# EAGLE schematic module_decoding_b (EAGLE 6.5.0)

## Sheet 1 of 11
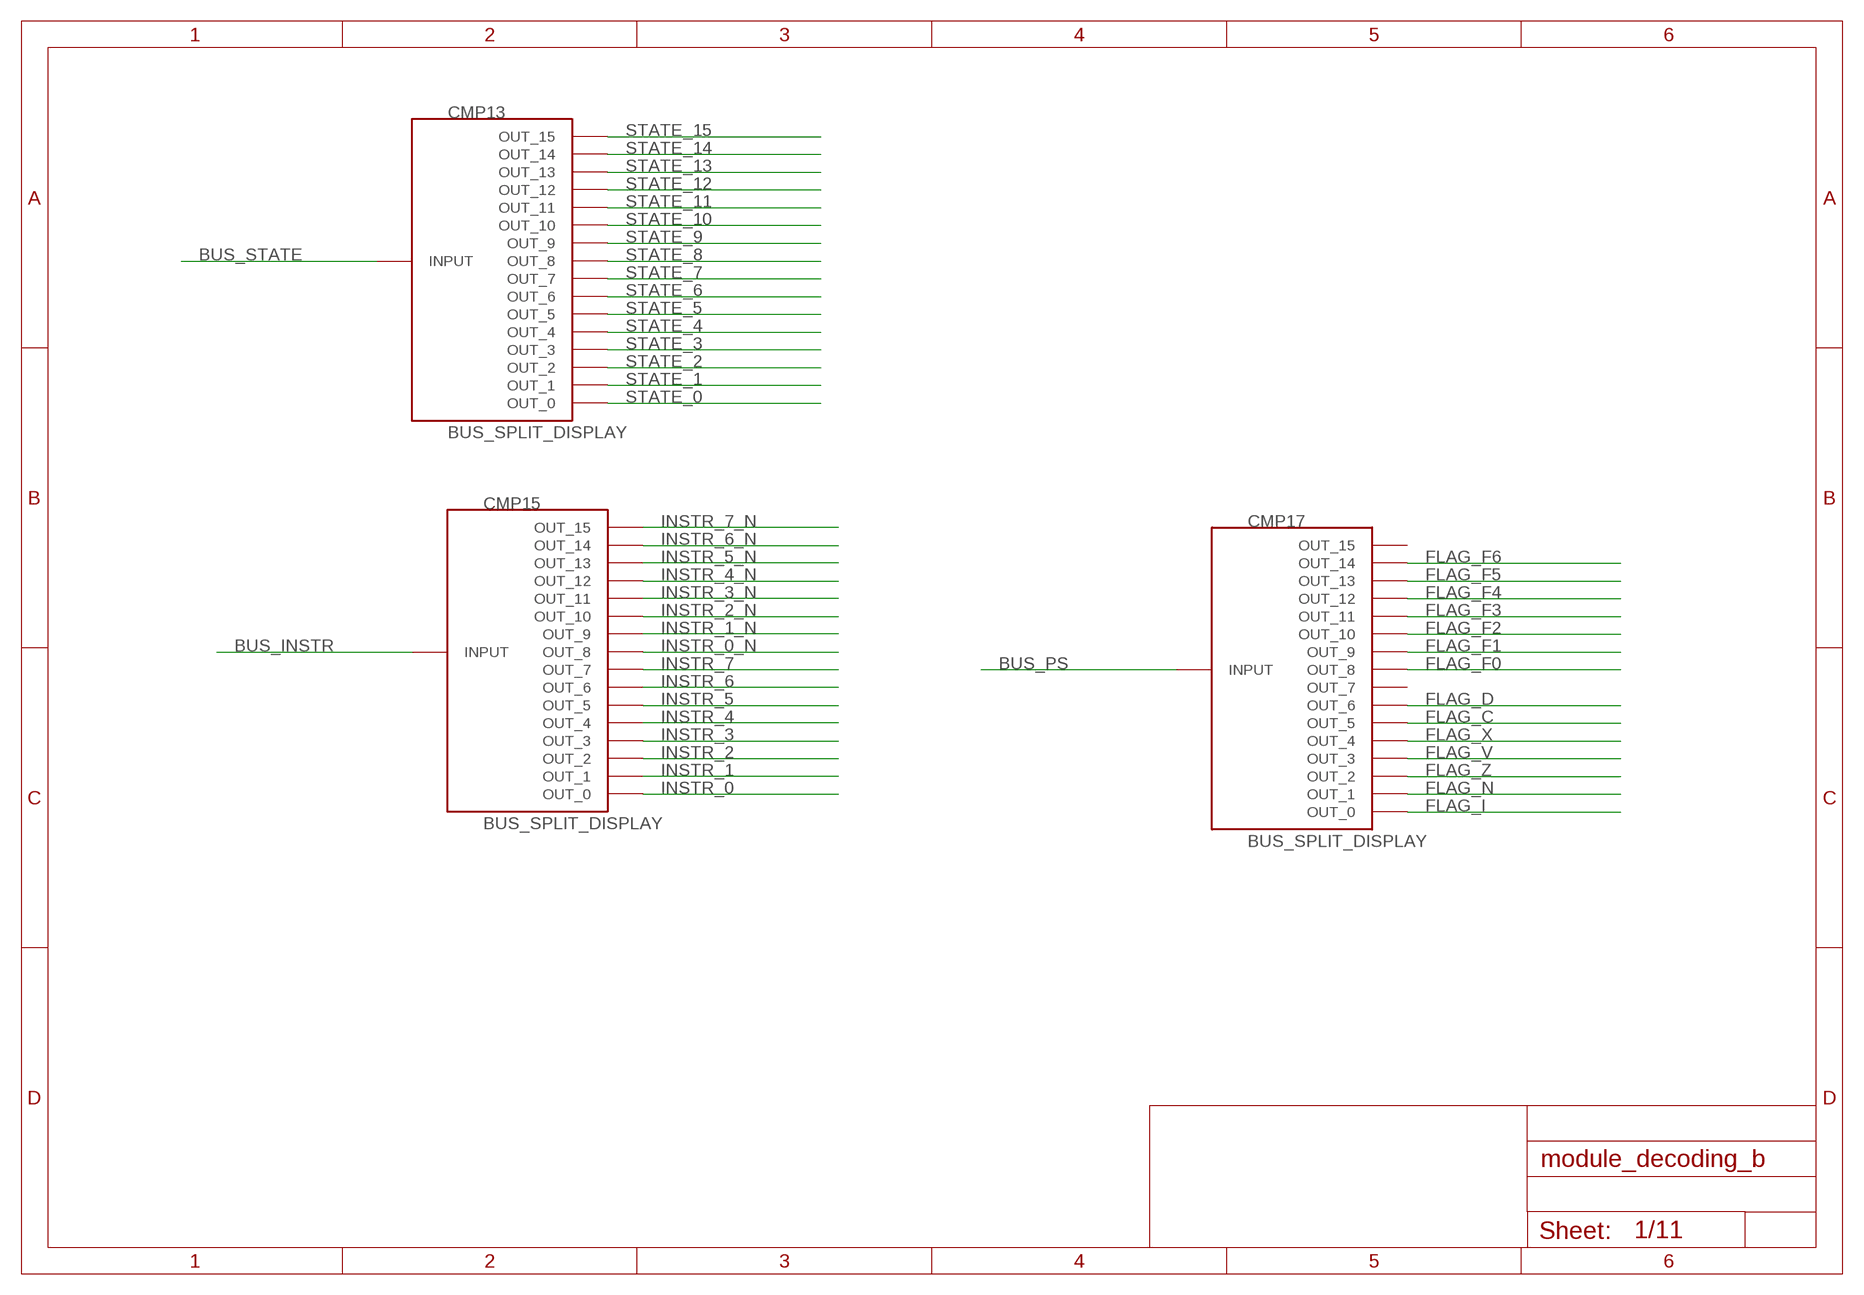
[diagram p0: schematic, sheet 1]

### Parts
CMP13  BUS_SPLIT_DISPLAY  [BUS_SPLIT_DISPLAY]
CMP15  BUS_SPLIT_DISPLAY  [BUS_SPLIT_DISPLAY]
CMP17  BUS_SPLIT_DISPLAY  [BUS_SPLIT_DISPLAY]

### Nets
BUS_INSTR: CMP15.INPUT
BUS_PS: CMP17.INPUT
BUS_STATE: CMP13.INPUT
FLAG_C: CMP17.P$6(OUT_5)
FLAG_D: CMP17.P$7(OUT_6)
FLAG_F0: CMP17.P$9(OUT_8) ; also sheet 6
FLAG_F1: CMP17.P$10(OUT_9) ; also sheet 6
FLAG_F2: CMP17.P$11(OUT_10)
FLAG_F3: CMP17.P$12(OUT_11) ; also sheet 8
FLAG_F4: CMP17.P$13(OUT_12)
FLAG_F5: CMP17.P$14(OUT_13)
FLAG_F6: CMP17.P$15(OUT_14)
FLAG_I: CMP17.P$1(OUT_0)
FLAG_N: CMP17.P$2(OUT_1)
FLAG_V: CMP17.P$4(OUT_3)
FLAG_X: CMP17.P$5(OUT_4) ; also sheet 8
FLAG_Z: CMP17.P$3(OUT_2)
INSTR_0: CMP15.P$1(OUT_0)
INSTR_0_N: CMP15.P$9(OUT_8)
INSTR_1: CMP15.P$2(OUT_1)
INSTR_1_N: CMP15.P$10(OUT_9)
INSTR_2: CMP15.P$3(OUT_2)
INSTR_2_N: CMP15.P$11(OUT_10) ; also sheet 8
INSTR_3: CMP15.P$4(OUT_3) ; also sheet 8
INSTR_3_N: CMP15.P$12(OUT_11)
INSTR_4: CMP15.P$5(OUT_4)
INSTR_4_N: CMP15.P$13(OUT_12)
INSTR_5: CMP15.P$6(OUT_5)
INSTR_5_N: CMP15.P$14(OUT_13)
INSTR_6: CMP15.P$7(OUT_6)
INSTR_6_N: CMP15.P$15(OUT_14)
INSTR_7: CMP15.P$8(OUT_7)
INSTR_7_N: CMP15.P$16(OUT_15)
STATE_0: CMP13.P$1(OUT_0) ; also sheet 5,7
STATE_1: CMP13.P$2(OUT_1)
STATE_2: CMP13.P$3(OUT_2) ; also sheet 5
STATE_3: CMP13.P$4(OUT_3) ; also sheet 6
STATE_4: CMP13.P$5(OUT_4)
STATE_5: CMP13.P$6(OUT_5) ; also sheet 7
STATE_6: CMP13.P$7(OUT_6)
STATE_7: CMP13.P$8(OUT_7) ; also sheet 5
STATE_8: CMP13.P$9(OUT_8)
STATE_9: CMP13.P$10(OUT_9)
STATE_10: CMP13.P$11(OUT_10)
STATE_11: CMP13.P$12(OUT_11)
STATE_12: CMP13.P$13(OUT_12)
STATE_13: CMP13.P$14(OUT_13) ; also sheet 8
STATE_14: CMP13.P$15(OUT_14)
STATE_15: CMP13.P$16(OUT_15)
Unconnected: CMP17.P$8(OUT_7) CMP17.P$16(OUT_15)

## Sheet 2 of 11
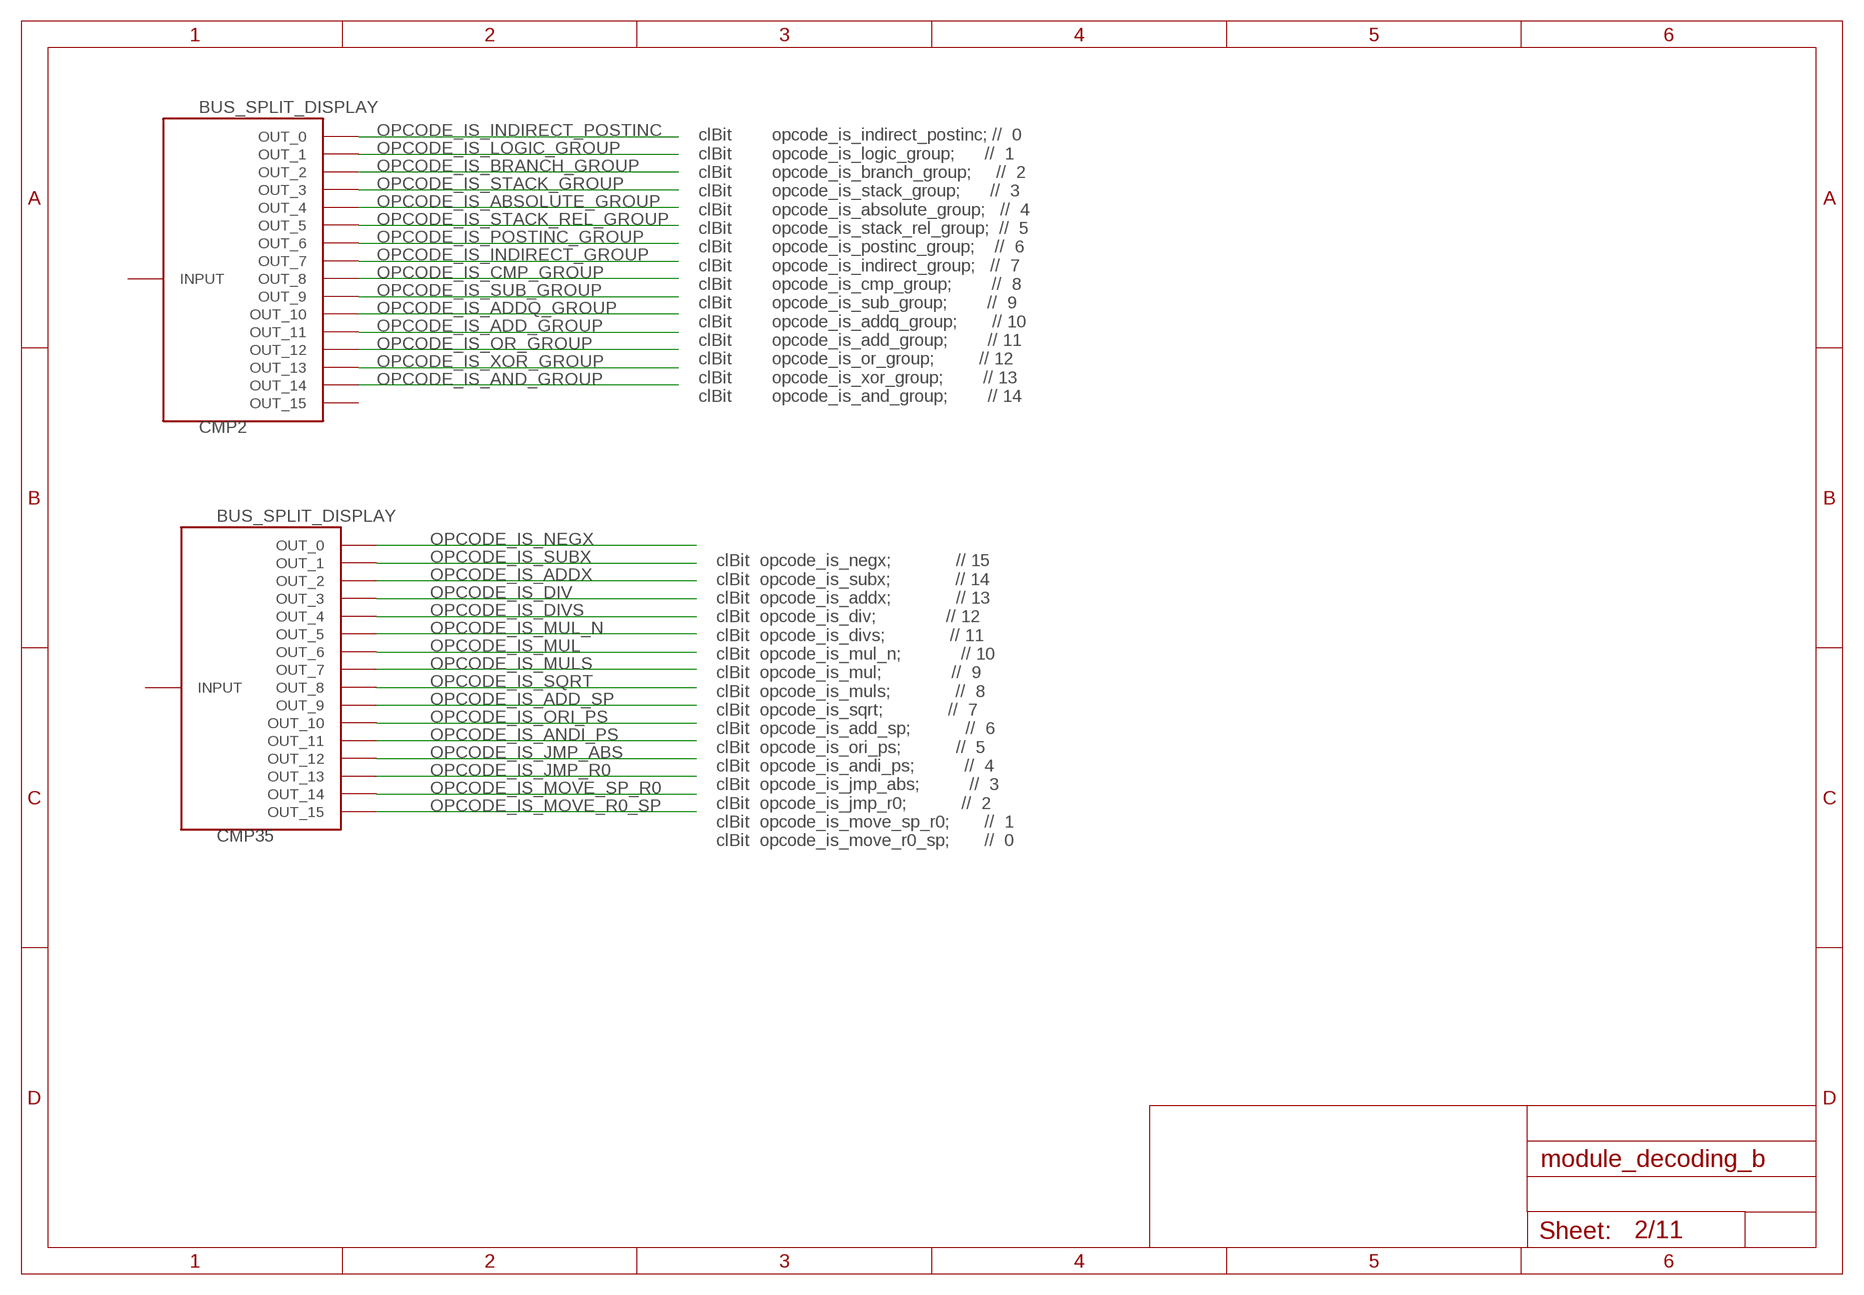
[diagram p1: schematic, sheet 2]

### Parts
CMP2  BUS_SPLIT_DISPLAY  [BUS_SPLIT_DISPLAY]
CMP35  BUS_SPLIT_DISPLAY  [BUS_SPLIT_DISPLAY]

### Nets
OPCODE_IS_ABSOLUTE_GROUP: CMP2.P$5(OUT_4)
OPCODE_IS_ADD_GROUP: CMP2.P$12(OUT_11) ; also sheet 7,10
OPCODE_IS_ADD_SP: CMP35.P$10(OUT_9) ; also sheet 5
OPCODE_IS_ADDQ_GROUP: CMP2.P$11(OUT_10) ; also sheet 7,8,10
OPCODE_IS_ADDX: CMP35.P$3(OUT_2) ; also sheet 10,11
OPCODE_IS_AND_GROUP: CMP2.P$15(OUT_14) ; also sheet 10
OPCODE_IS_ANDI_PS: CMP35.P$12(OUT_11) ; also sheet 9
OPCODE_IS_BRANCH_GROUP: CMP2.P$3(OUT_2) ; also sheet 5,9
OPCODE_IS_CMP_GROUP: CMP2.P$9(OUT_8) ; also sheet 10
OPCODE_IS_DIV: CMP35.P$4(OUT_3) ; also sheet 5,10,11
OPCODE_IS_DIVS: CMP35.P$5(OUT_4) ; also sheet 5,6
OPCODE_IS_INDIRECT_GROUP: CMP2.P$8(OUT_7)
OPCODE_IS_INDIRECT_POSTINC: CMP2.P$1(OUT_0) ; also sheet 10,11
OPCODE_IS_JMP_ABS: CMP35.P$13(OUT_12)
OPCODE_IS_JMP_R0: CMP35.P$14(OUT_13) ; also sheet 10
OPCODE_IS_LOGIC_GROUP: CMP2.P$2(OUT_1) ; also sheet 10
OPCODE_IS_MOVE_R0_SP: CMP35.P$16(OUT_15) ; also sheet 5
OPCODE_IS_MOVE_SP_R0: CMP35.P$15(OUT_14) ; also sheet 10
OPCODE_IS_MUL: CMP35.P$7(OUT_6) ; also sheet 11
OPCODE_IS_MUL_N: CMP35.P$6(OUT_5) ; also sheet 8,10
OPCODE_IS_MULS: CMP35.P$8(OUT_7) ; also sheet 10,11
OPCODE_IS_NEGX: CMP35.P$1(OUT_0) ; also sheet 10,11
OPCODE_IS_OR_GROUP: CMP2.P$13(OUT_12) ; also sheet 10
OPCODE_IS_ORI_PS: CMP35.P$11(OUT_10) ; also sheet 9
OPCODE_IS_POSTINC_GROUP: CMP2.P$7(OUT_6) ; also sheet 11
OPCODE_IS_SQRT: CMP35.P$9(OUT_8) ; also sheet 10,11
OPCODE_IS_STACK_GROUP: CMP2.P$4(OUT_3) ; also sheet 10,11
OPCODE_IS_STACK_REL_GROUP: CMP2.P$6(OUT_5) ; also sheet 5
OPCODE_IS_SUB_GROUP: CMP2.P$10(OUT_9) ; also sheet 9,10
OPCODE_IS_SUBX: CMP35.P$2(OUT_1) ; also sheet 10,11
OPCODE_IS_XOR_GROUP: CMP2.P$14(OUT_13) ; also sheet 10
Unconnected: CMP2.INPUT CMP2.P$16(OUT_15) CMP35.INPUT

### Notes on the sheet
- clBit        opcode_is_indirect_postinc; //  0
      clBit        opcode_is_logic_group;      //  1
      clBit        opcode_is_branch_group;     //  2
      clBit        opcode_is_stack_group;      //  3
      clBit        opcode_is_absolute_group;   //  4
      clBit        opcode_is_stack_rel_group;  //  5
      clBit        opcode_is_postinc_group;    //  6
      clBit        opcode_is_indirect_group;   //  7
      clBit        opcode_is_cmp_group;        //  8
      clBit        opcode_is_sub_group;        //  9
      clBit        opcode_is_addq_group;       // 10
      clBit        opcode_is_add_group;        // 11
      clBit        opcode_is_or_group;         // 12
      clBit        opcode_is_xor_group;        // 13
      clBit        opcode_is_and_group;        // 14
- clBit  opcode_is_negx;             // 15
      clBit  opcode_is_subx;             // 14
      clBit  opcode_is_addx;             // 13
      clBit  opcode_is_div;              // 12
      clBit  opcode_is_divs;             // 11
      clBit  opcode_is_mul_n;            // 10
      clBit  opcode_is_mul;              //  9
      clBit  opcode_is_muls;             //  8
      clBit  opcode_is_sqrt;             //  7
      clBit  opcode_is_add_sp;           //  6
      clBit  opcode_is_ori_ps;           //  5
      clBit  opcode_is_andi_ps;          //  4
      clBit  opcode_is_jmp_abs;          //  3
      clBit  opcode_is_jmp_r0;           //  2
      clBit  opcode_is_move_sp_r0;       //  1
      clBit  opcode_is_move_r0_sp;       //  0

## Sheet 3 of 11
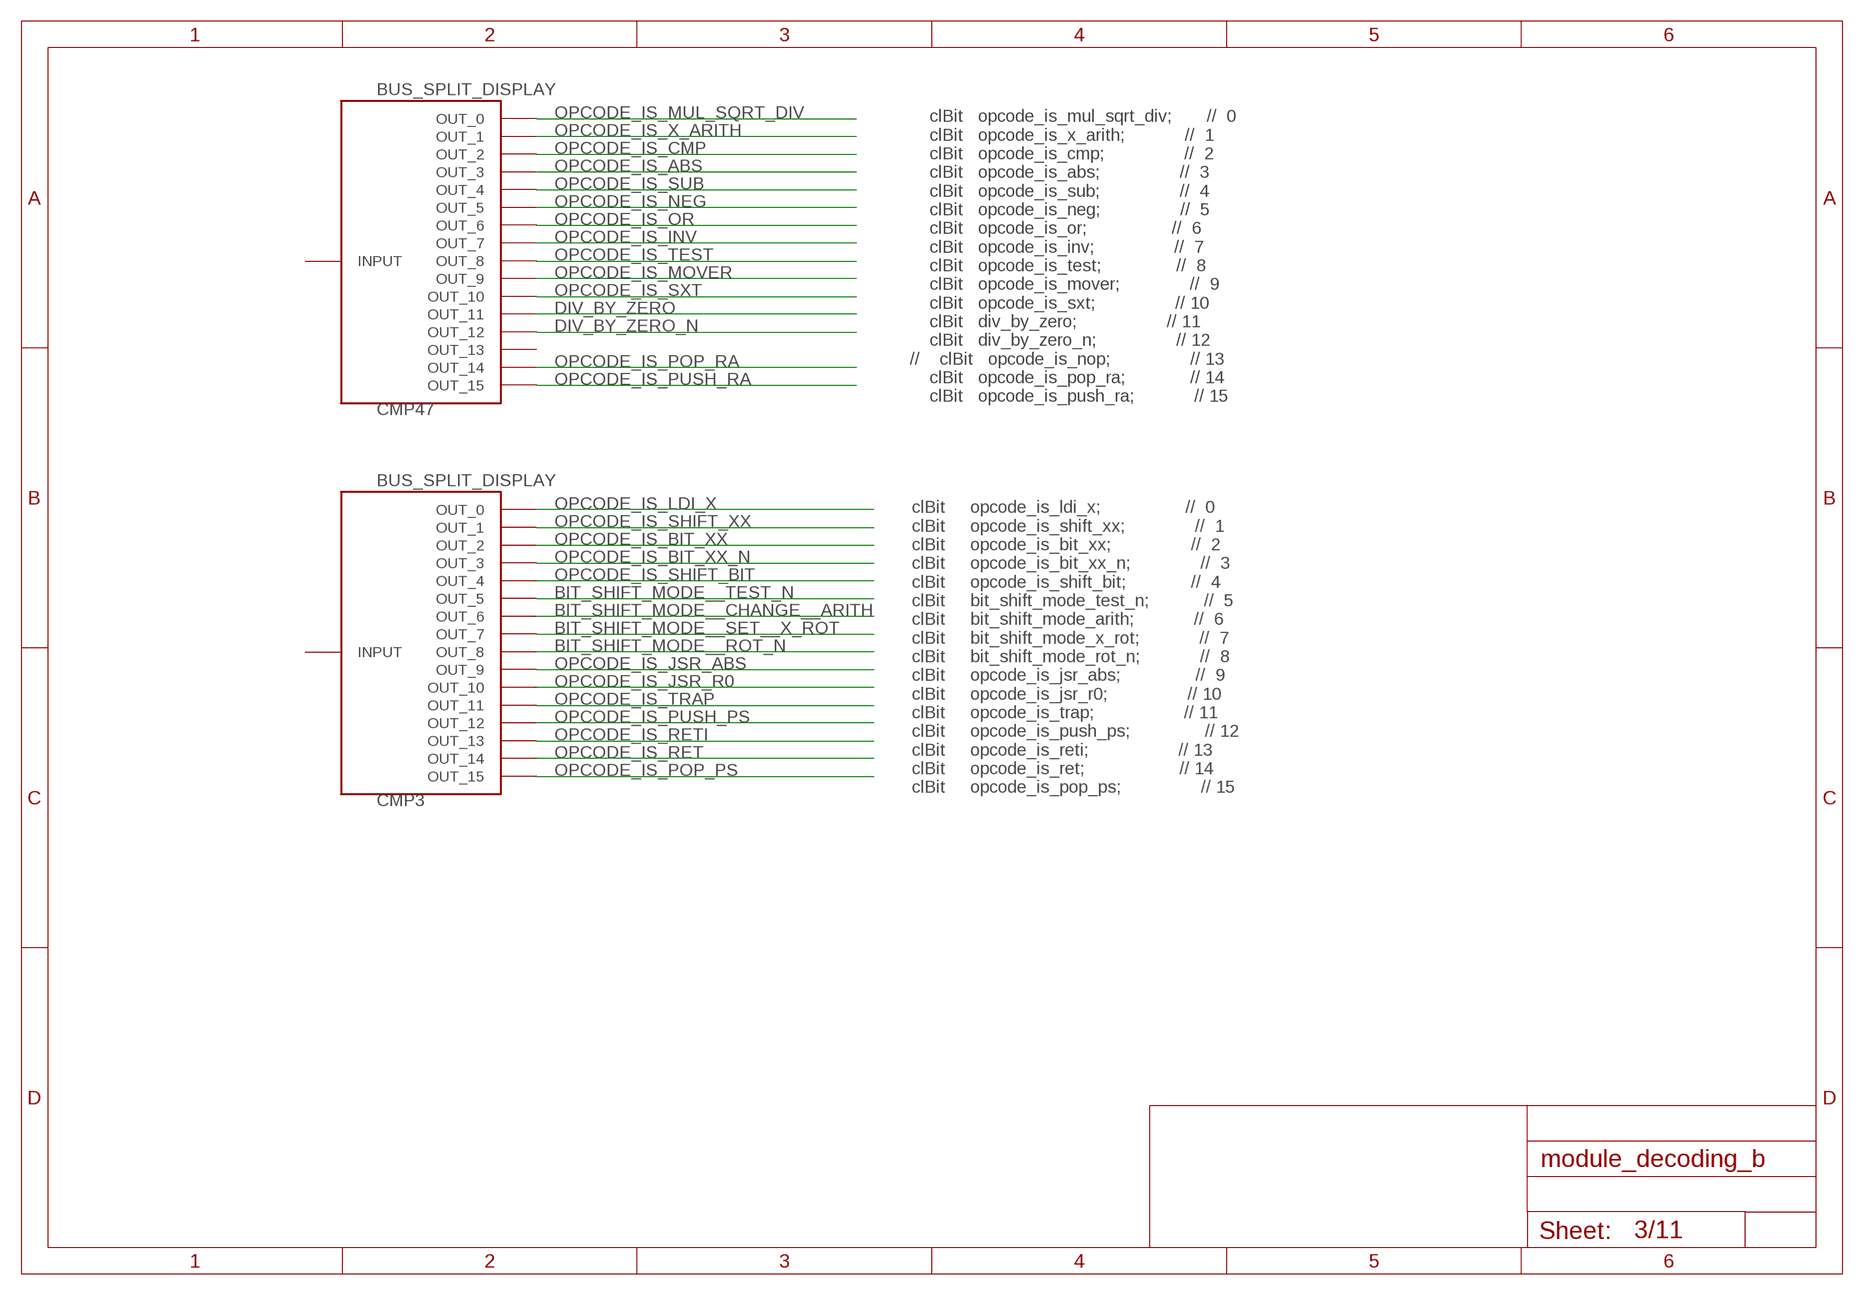
[diagram p2: schematic, sheet 3]

### Parts
CMP3  BUS_SPLIT_DISPLAY  [BUS_SPLIT_DISPLAY]
CMP47  BUS_SPLIT_DISPLAY  [BUS_SPLIT_DISPLAY]

### Nets
BIT_SHIFT_MODE__CHANGE__ARITH: CMP3.P$7(OUT_6) ; also sheet 9
BIT_SHIFT_MODE__ROT_N: CMP3.P$9(OUT_8) ; also sheet 7
BIT_SHIFT_MODE__SET__X_ROT: CMP3.P$8(OUT_7) ; also sheet 9
BIT_SHIFT_MODE__TEST_N: CMP3.P$6(OUT_5) ; also sheet 6
DIV_BY_ZERO: CMP47.P$12(OUT_11) ; also sheet 9
DIV_BY_ZERO_N: CMP47.P$13(OUT_12) ; also sheet 11
OPCODE_IS_ABS: CMP47.P$4(OUT_3) ; also sheet 9,10
OPCODE_IS_BIT_XX: CMP3.P$3(OUT_2) ; also sheet 6,9,10
OPCODE_IS_BIT_XX_N: CMP3.P$4(OUT_3) ; also sheet 10
OPCODE_IS_CMP: CMP47.P$3(OUT_2) ; also sheet 6,9,10
OPCODE_IS_INV: CMP47.P$8(OUT_7) ; also sheet 10
OPCODE_IS_JSR_ABS: CMP3.P$10(OUT_9) ; also sheet 10,11
OPCODE_IS_JSR_R0: CMP3.P$11(OUT_10) ; also sheet 10,11
OPCODE_IS_LDI_X: CMP3.P$1(OUT_0) ; also sheet 7,11
OPCODE_IS_MOVER: CMP47.P$10(OUT_9) ; also sheet 10
OPCODE_IS_MUL_SQRT_DIV: CMP47.P$1(OUT_0) ; also sheet 7,9
OPCODE_IS_NEG: CMP47.P$6(OUT_5) ; also sheet 9,10
OPCODE_IS_OR: CMP47.P$7(OUT_6) ; also sheet 10
OPCODE_IS_POP_PS: CMP3.P$16(OUT_15) ; also sheet 6,9,11
OPCODE_IS_POP_RA: CMP47.P$15(OUT_14) ; also sheet 6,7
OPCODE_IS_PUSH_PS: CMP3.P$13(OUT_12) ; also sheet 10
OPCODE_IS_PUSH_RA: CMP47.P$16(OUT_15) ; also sheet 7,10
OPCODE_IS_RET: CMP3.P$15(OUT_14) ; also sheet 6
OPCODE_IS_RETI: CMP3.P$14(OUT_13) ; also sheet 6
OPCODE_IS_SHIFT_BIT: CMP3.P$5(OUT_4) ; also sheet 11
OPCODE_IS_SHIFT_XX: CMP3.P$2(OUT_1) ; also sheet 7,9,10
OPCODE_IS_SUB: CMP47.P$5(OUT_4) ; also sheet 9,10
OPCODE_IS_SXT: CMP47.P$11(OUT_10) ; also sheet 7,11
OPCODE_IS_TEST: CMP47.P$9(OUT_8) ; also sheet 6
OPCODE_IS_TRAP: CMP3.P$12(OUT_11) ; also sheet 9,10,11
OPCODE_IS_X_ARITH: CMP47.P$2(OUT_1) ; also sheet 9,11
Unconnected: CMP3.INPUT CMP47.INPUT CMP47.P$14(OUT_13)

### Notes on the sheet
- clBit   opcode_is_mul_sqrt_div;       //  0
      clBit   opcode_is_x_arith;            //  1
      clBit   opcode_is_cmp;                //  2
      clBit   opcode_is_abs;                //  3
      clBit   opcode_is_sub;                //  4
      clBit   opcode_is_neg;                //  5
      clBit   opcode_is_or;                 //  6
      clBit   opcode_is_inv;                //  7
      clBit   opcode_is_test;               //  8
      clBit   opcode_is_mover;              //  9
      clBit   opcode_is_sxt;                // 10
      clBit   div_by_zero;                  // 11
      clBit   div_by_zero_n;                // 12
  //    clBit   opcode_is_nop;                // 13
      clBit   opcode_is_pop_ra;             // 14
      clBit   opcode_is_push_ra;            // 15
- clBit     opcode_is_ldi_x;                 //  0
      clBit     opcode_is_shift_xx;              //  1
      clBit     opcode_is_bit_xx;                //  2
      clBit     opcode_is_bit_xx_n;              //  3
      clBit     opcode_is_shift_bit;             //  4
      clBit     bit_shift_mode_test_n;           //  5
      clBit     bit_shift_mode_arith;            //  6
      clBit     bit_shift_mode_x_rot;            //  7
      clBit     bit_shift_mode_rot_n;            //  8
      clBit     opcode_is_jsr_abs;               //  9
      clBit     opcode_is_jsr_r0;                // 10
      clBit     opcode_is_trap;                  // 11
      clBit     opcode_is_push_ps;               // 12
      clBit     opcode_is_reti;                  // 13
      clBit     opcode_is_ret;                   // 14
      clBit     opcode_is_pop_ps;                // 15

## Sheet 4 of 11
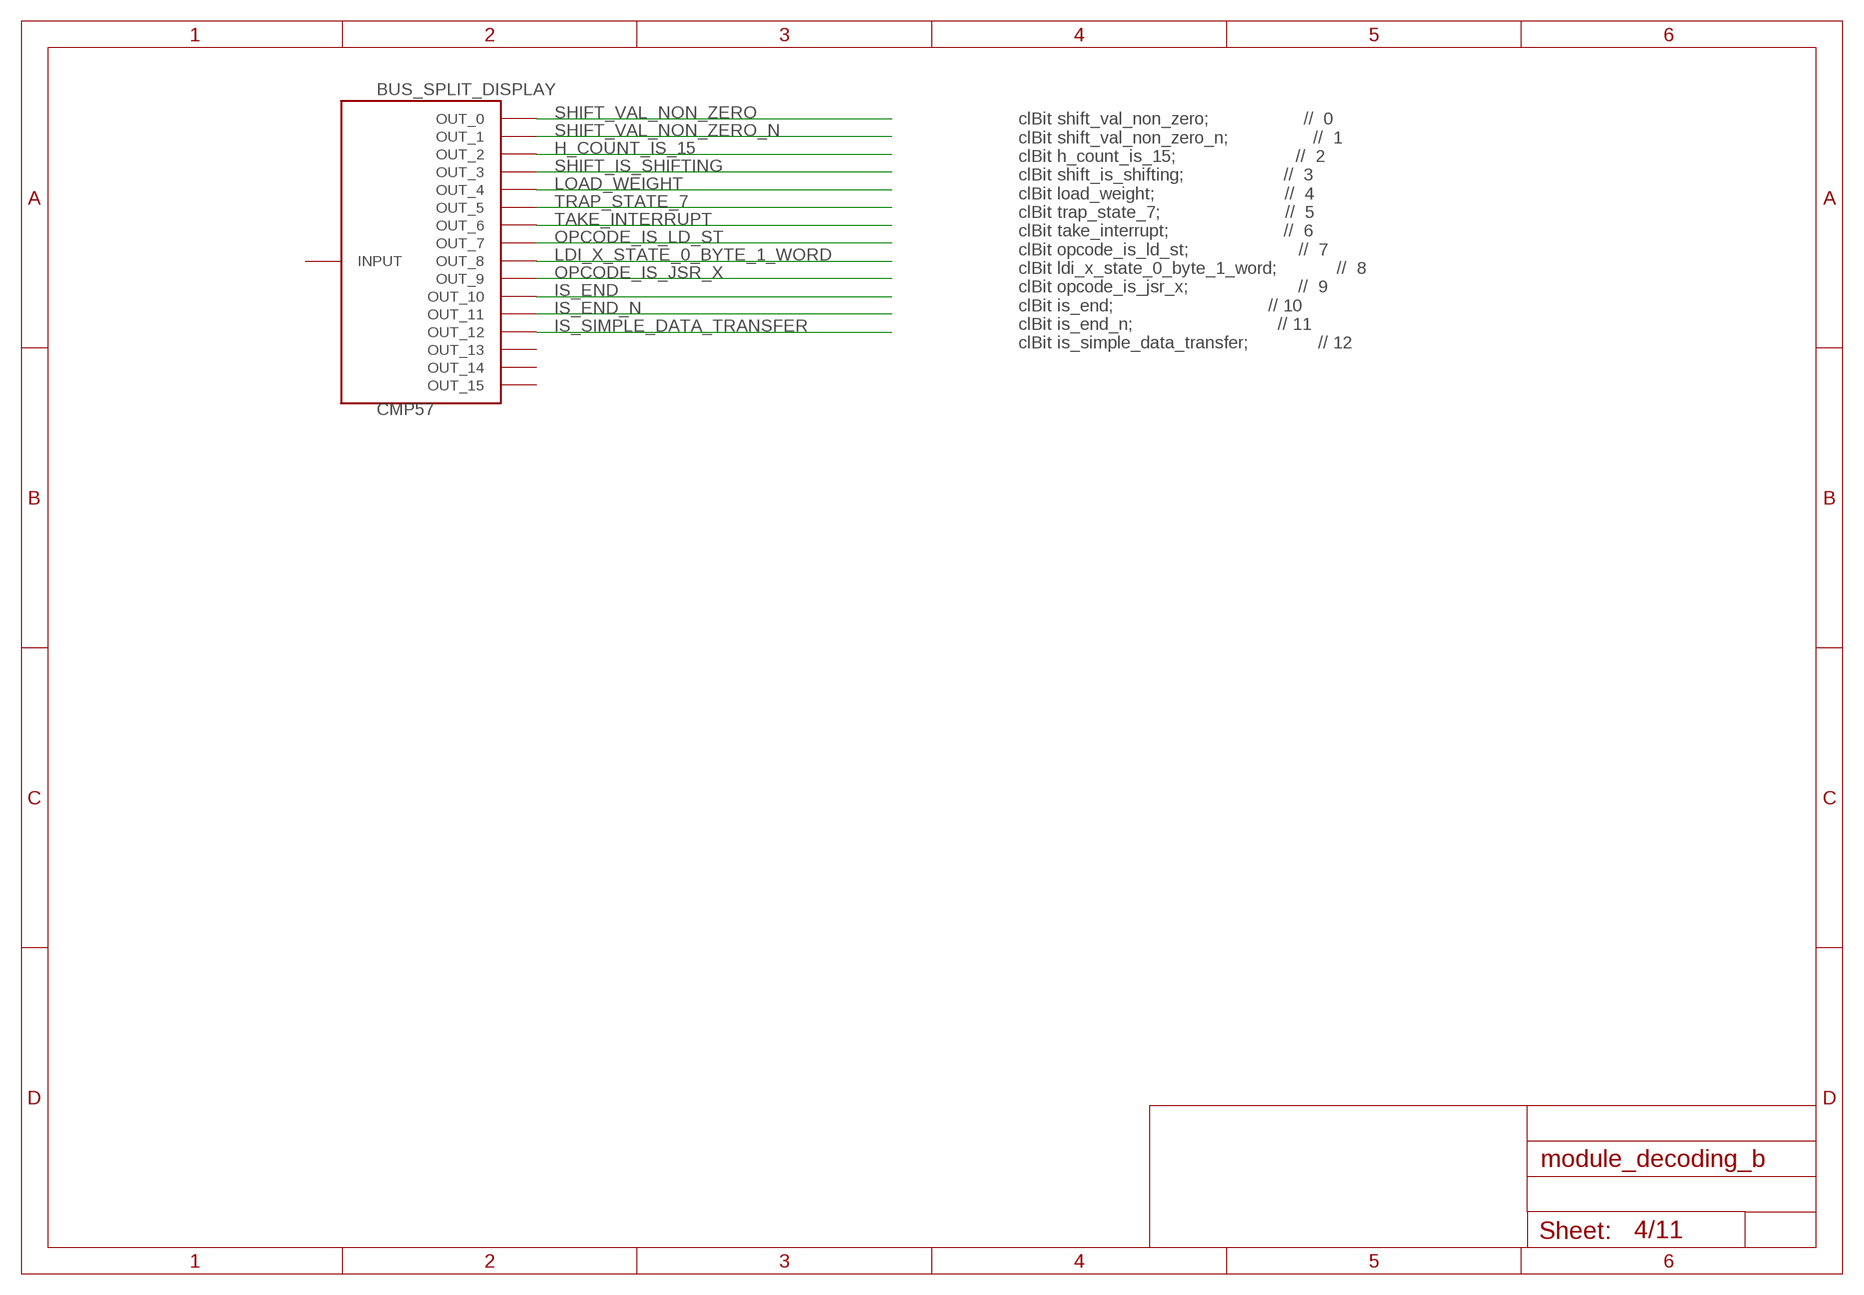
[diagram p3: schematic, sheet 4]

### Parts
CMP57  BUS_SPLIT_DISPLAY  [BUS_SPLIT_DISPLAY]

### Nets
H_COUNT_IS_15: CMP57.P$3(OUT_2) ; also sheet 9
IS_END: CMP57.P$11(OUT_10)
IS_END_N: CMP57.P$12(OUT_11) ; also sheet 11
IS_SIMPLE_DATA_TRANSFER: CMP57.P$13(OUT_12)
LDI_X_STATE_0_BYTE_1_WORD: CMP57.P$9(OUT_8) ; also sheet 9
LOAD_WEIGHT: CMP57.P$5(OUT_4) ; also sheet 9,11
OPCODE_IS_JSR_X: CMP57.P$10(OUT_9) ; also sheet 5
OPCODE_IS_LD_ST: CMP57.P$8(OUT_7) ; also sheet 7,11
SHIFT_IS_SHIFTING: CMP57.P$4(OUT_3) ; also sheet 7,9,10,11
SHIFT_VAL_NON_ZERO: CMP57.P$1(OUT_0)
SHIFT_VAL_NON_ZERO_N: CMP57.P$2(OUT_1)
TAKE_INTERRUPT: CMP57.P$7(OUT_6) ; also sheet 9
TRAP_STATE_7: CMP57.P$6(OUT_5) ; also sheet 9
Unconnected: CMP57.INPUT CMP57.P$14(OUT_13) CMP57.P$15(OUT_14) CMP57.P$16(OUT_15)

### Notes on the sheet
- clBit shift_val_non_zero;                   //  0
      clBit shift_val_non_zero_n;                 //  1
      clBit h_count_is_15;                        //  2
      clBit shift_is_shifting;                    //  3
      clBit load_weight;                          //  4
      clBit trap_state_7;                         //  5
      clBit take_interrupt;                       //  6
      clBit opcode_is_ld_st;                      //  7
      clBit ldi_x_state_0_byte_1_word;            //  8
      clBit opcode_is_jsr_x;                      //  9
      clBit is_end;                               // 10
      clBit is_end_n;                             // 11
      clBit is_simple_data_transfer;              // 12

## Sheet 5 of 11
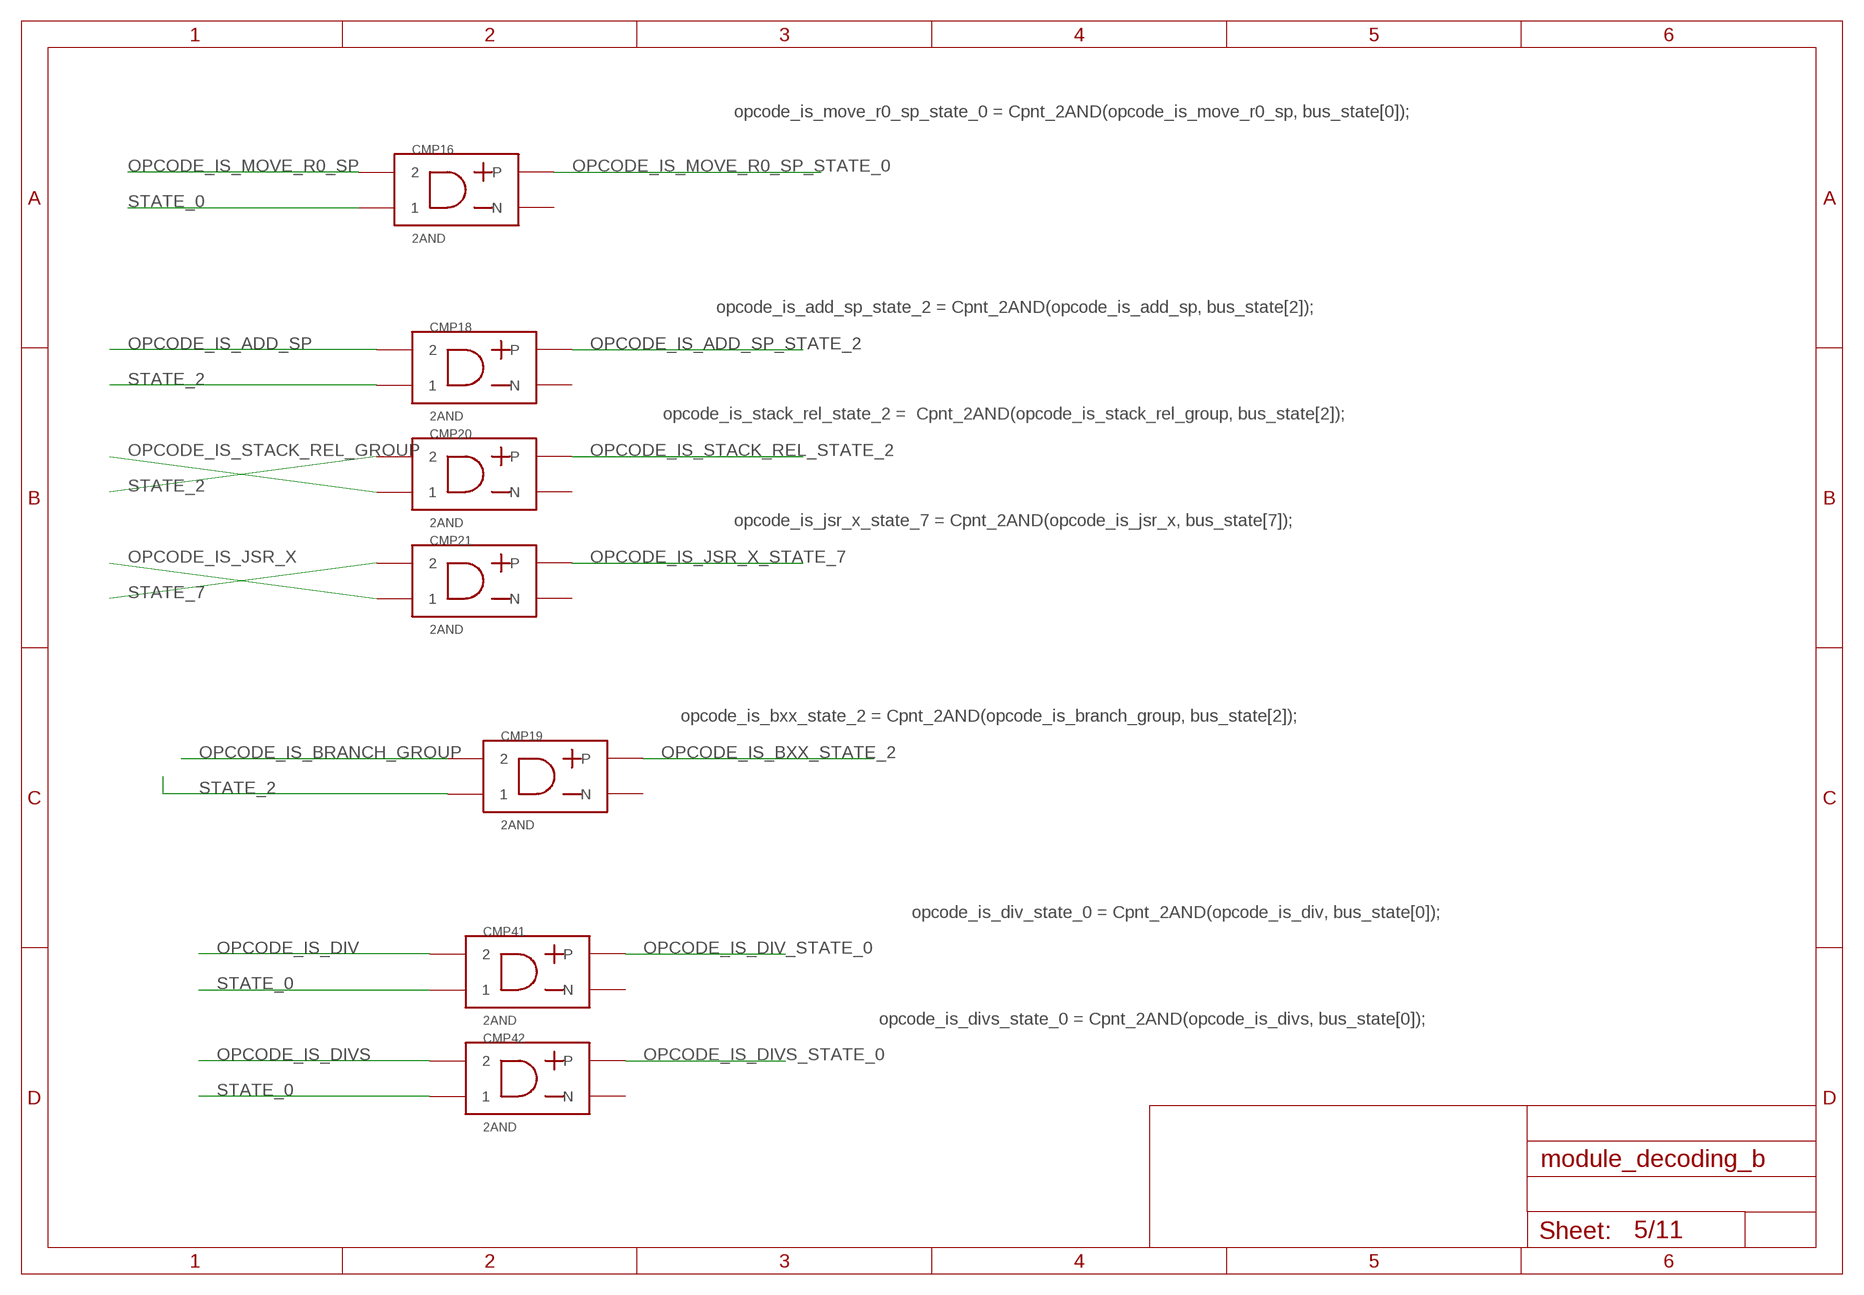
[diagram p4: schematic, sheet 5]

### Parts
CMP16  2AND  [2AND]
CMP18  2AND  [2AND]
CMP19  2AND  [2AND]
CMP20  2AND  [2AND]
CMP21  2AND  [2AND]
CMP41  2AND  [2AND]
CMP42  2AND  [2AND]

### Nets
OPCODE_IS_ADD_SP: CMP18.P$2 ; also sheet 2
OPCODE_IS_ADD_SP_STATE_2: CMP18.OUT_P(P) ; also sheet 10,11
OPCODE_IS_BRANCH_GROUP: CMP19.P$2 ; also sheet 2,9
OPCODE_IS_BXX_STATE_2: CMP19.OUT_P(P) ; also sheet 10
OPCODE_IS_DIV: CMP41.P$2 ; also sheet 2,10,11
OPCODE_IS_DIV_STATE_0: CMP41.OUT_P(P) ; also sheet 10,11
OPCODE_IS_DIVS: CMP42.P$2 ; also sheet 2,6
OPCODE_IS_DIVS_STATE_0: CMP42.OUT_P(P) ; also sheet 10,11
OPCODE_IS_JSR_X: CMP21.P$1 ; also sheet 4
OPCODE_IS_JSR_X_STATE_7: CMP21.OUT_P(P) ; also sheet 10
OPCODE_IS_MOVE_R0_SP: CMP16.P$2 ; also sheet 2
OPCODE_IS_MOVE_R0_SP_STATE_0: CMP16.OUT_P(P) ; also sheet 10,11
OPCODE_IS_STACK_REL_GROUP: CMP20.P$1 ; also sheet 2
OPCODE_IS_STACK_REL_STATE_2: CMP20.OUT_P(P) ; also sheet 10,11
STATE_0: CMP16.P$1 CMP41.P$1 CMP42.P$1 ; also sheet 1,7
STATE_2: CMP18.P$1 CMP19.P$1 CMP20.P$2 ; also sheet 1
STATE_7: CMP21.P$2 ; also sheet 1
Unconnected: CMP16.OUT_M(N) CMP18.OUT_M(N) CMP19.OUT_M(N) CMP20.OUT_M(N) CMP21.OUT_M(N) CMP41.OUT_M(N) CMP42.OUT_M(N)

### Notes on the sheet
- opcode_is_move_r0_sp_state_0 = Cpnt_2AND(opcode_is_move_r0_sp, bus_state[0]);
- opcode_is_add_sp_state_2 = Cpnt_2AND(opcode_is_add_sp, bus_state[2]);
- opcode_is_stack_rel_state_2 =  Cpnt_2AND(opcode_is_stack_rel_group, bus_state[2]);
- opcode_is_jsr_x_state_7 = Cpnt_2AND(opcode_is_jsr_x, bus_state[7]);
- opcode_is_bxx_state_2 = Cpnt_2AND(opcode_is_branch_group, bus_state[2]);
- opcode_is_div_state_0 = Cpnt_2AND(opcode_is_div, bus_state[0]);
- opcode_is_divs_state_0 = Cpnt_2AND(opcode_is_divs, bus_state[0]);

## Sheet 6 of 11
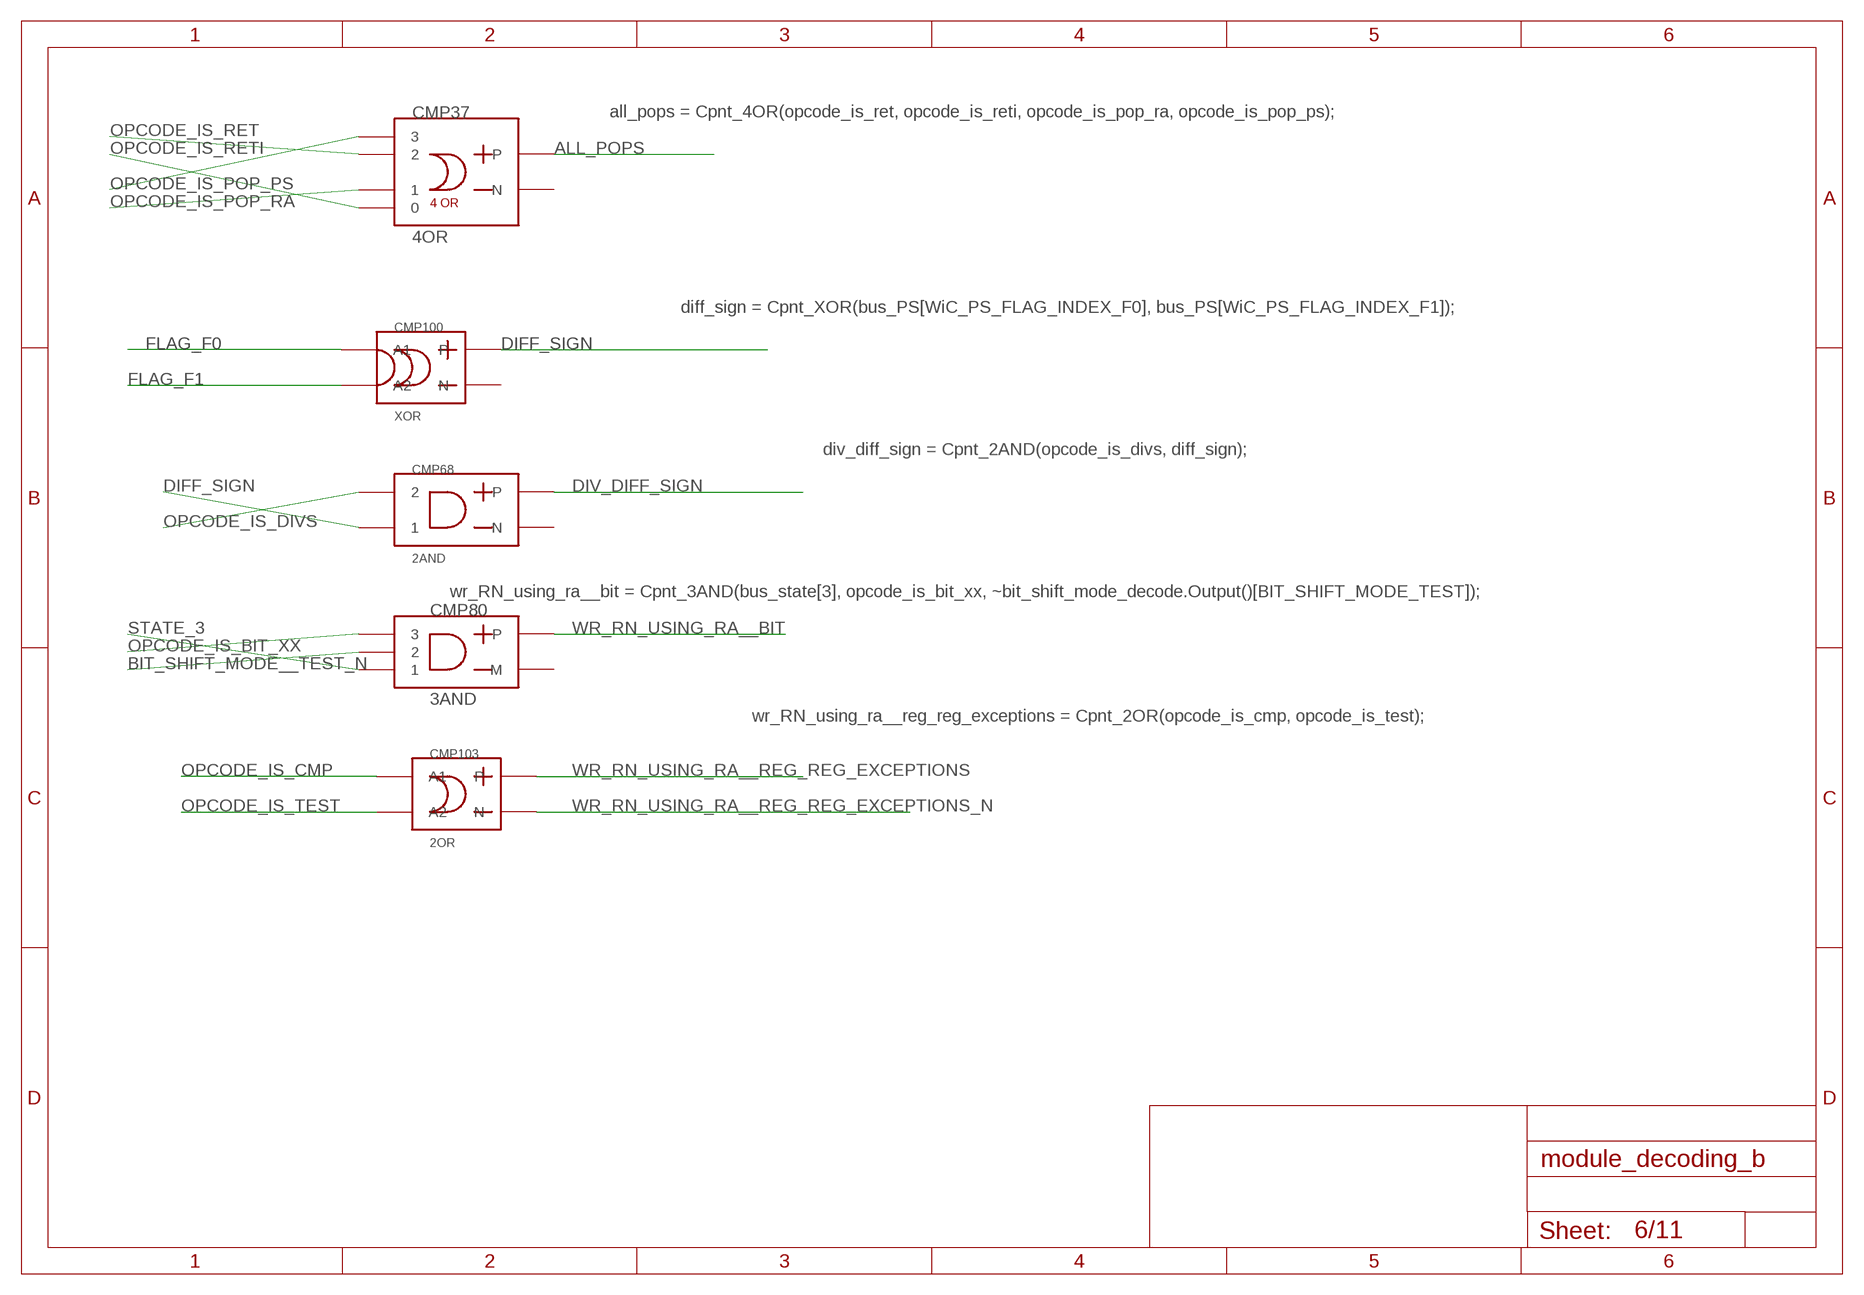
[diagram p5: schematic, sheet 6]

### Parts
CMP37  4OR  [4OR]
CMP68  2AND  [2AND]
CMP80  3AND  [3AND]
CMP100  XOR  [XOR]
CMP103  2OR  [2OR]

### Nets
ALL_POPS: CMP37.OUT_P(P) ; also sheet 11
BIT_SHIFT_MODE__TEST_N: CMP80.P$2 ; also sheet 3
DIFF_SIGN: CMP68.P$1 CMP100.OUT_P(P)
DIV_DIFF_SIGN: CMP68.OUT_P(P) ; also sheet 11
FLAG_F0: CMP100.P$1(A1) ; also sheet 1
FLAG_F1: CMP100.P$2(A2) ; also sheet 1
OPCODE_IS_BIT_XX: CMP80.P$3 ; also sheet 3,9,10
OPCODE_IS_CMP: CMP103.P$2(A1) ; also sheet 3,9,10
OPCODE_IS_DIVS: CMP68.P$2 ; also sheet 2,5
OPCODE_IS_POP_PS: CMP37.4 ; also sheet 3,9,11
OPCODE_IS_POP_RA: CMP37.2 ; also sheet 3,7
OPCODE_IS_RET: CMP37.3 ; also sheet 3
OPCODE_IS_RETI: CMP37.1 ; also sheet 3
OPCODE_IS_TEST: CMP103.P$1(A2) ; also sheet 3
STATE_3: CMP80.P$1 ; also sheet 1
WR_RN_USING_RA__BIT: CMP80.OUT_P(P) ; also sheet 11
WR_RN_USING_RA__REG_REG_EXCEPTIONS: CMP103.OUT_P(P)
WR_RN_USING_RA__REG_REG_EXCEPTIONS_N: CMP103.OUT_M(N) ; also sheet 11
Unconnected: CMP37.OUT_M(N) CMP68.OUT_M(N) CMP80.OUT_M(M) CMP100.OUT_N(N)

### Notes on the sheet
- all_pops = Cpnt_4OR(opcode_is_ret, opcode_is_reti, opcode_is_pop_ra, opcode_is_pop_ps);
- diff_sign = Cpnt_XOR(bus_PS[WiC_PS_FLAG_INDEX_F0], bus_PS[WiC_PS_FLAG_INDEX_F1]);
- div_diff_sign = Cpnt_2AND(opcode_is_divs, diff_sign);
- wr_RN_using_ra__bit = Cpnt_3AND(bus_state[3], opcode_is_bit_xx, ~bit_shift_mode_decode.Output()[BIT_SHIFT_MODE_TEST]);
- wr_RN_using_ra__reg_reg_exceptions = Cpnt_2OR(opcode_is_cmp, opcode_is_test);

## Sheet 7 of 11
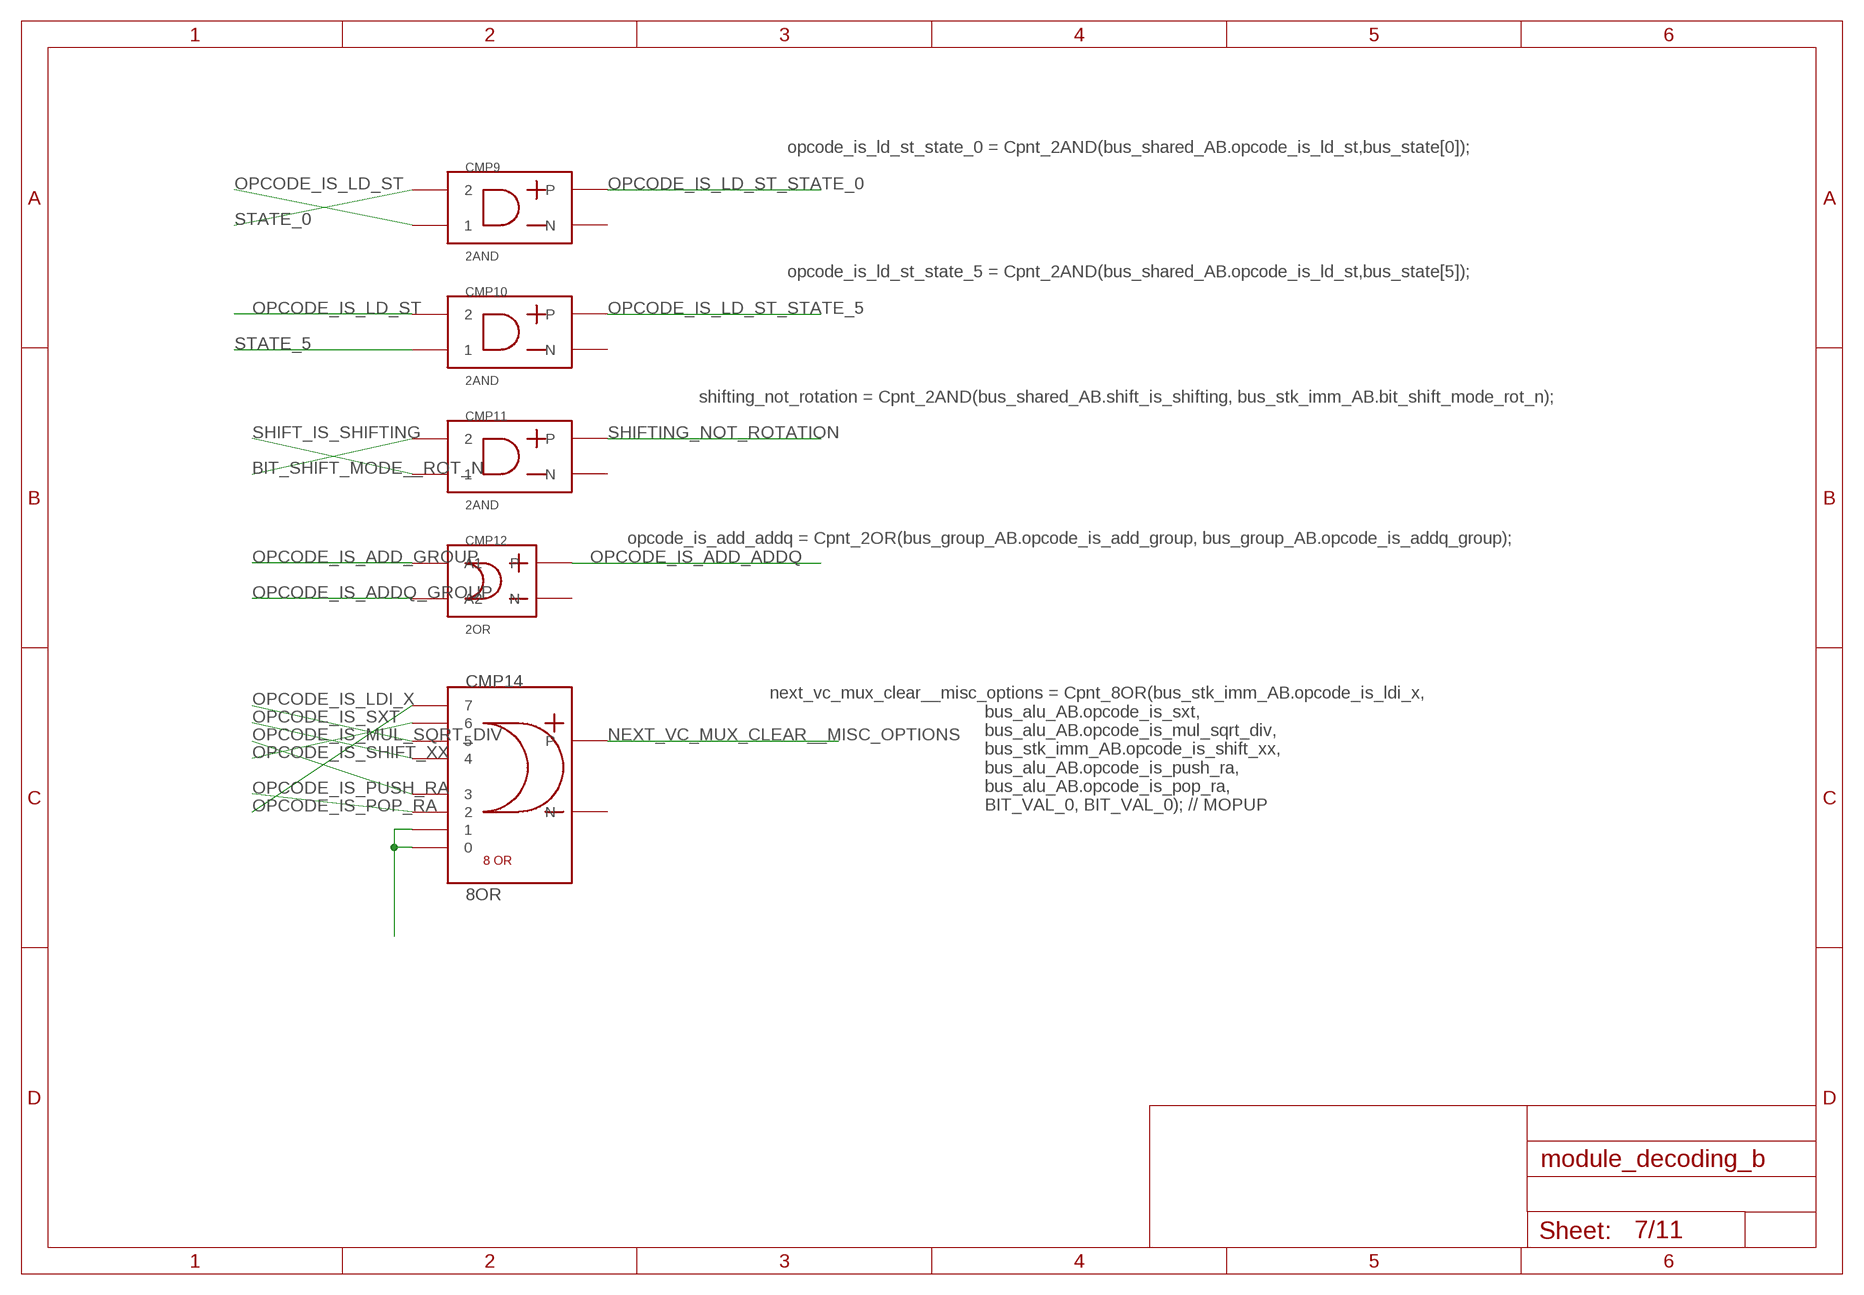
[diagram p6: schematic, sheet 7]

### Parts
CMP9  2AND  [2AND]
CMP10  2AND  [2AND]
CMP11  2AND  [2AND]
CMP12  2OR  [2OR]
CMP14  8OR  [8OR]

### Nets
BIT_SHIFT_MODE__ROT_N: CMP11.P$2 ; also sheet 3
N$1: CMP14.1 CMP14.2
NEXT_VC_MUX_CLEAR__MISC_OPTIONS: CMP14.OUT_P(P) ; also sheet 9
OPCODE_IS_ADD_ADDQ: CMP12.OUT_P(P) ; also sheet 9
OPCODE_IS_ADD_GROUP: CMP12.P$2(A1) ; also sheet 2,10
OPCODE_IS_ADDQ_GROUP: CMP12.P$1(A2) ; also sheet 2,8,10
OPCODE_IS_LD_ST: CMP9.P$1 CMP10.P$2 ; also sheet 4,11
OPCODE_IS_LD_ST_STATE_0: CMP9.OUT_P(P) ; also sheet 9
OPCODE_IS_LD_ST_STATE_5: CMP10.OUT_P(P) ; also sheet 9
OPCODE_IS_LDI_X: CMP14.6 ; also sheet 3,11
OPCODE_IS_MUL_SQRT_DIV: CMP14.4 ; also sheet 3,9
OPCODE_IS_POP_RA: CMP14.8 ; also sheet 3,6
OPCODE_IS_PUSH_RA: CMP14.3 ; also sheet 3,10
OPCODE_IS_SHIFT_XX: CMP14.7 ; also sheet 3,9,10
OPCODE_IS_SXT: CMP14.5 ; also sheet 3,11
SHIFT_IS_SHIFTING: CMP11.P$1 ; also sheet 4,9,10,11
SHIFTING_NOT_ROTATION: CMP11.OUT_P(P) ; also sheet 9
STATE_0: CMP9.P$2 ; also sheet 1,5
STATE_5: CMP10.P$1 ; also sheet 1
Unconnected: CMP9.OUT_M(N) CMP10.OUT_M(N) CMP11.OUT_M(N) CMP12.OUT_M(N) CMP14.OUT_M(N)

### Notes on the sheet
- opcode_is_ld_st_state_0 = Cpnt_2AND(bus_shared_AB.opcode_is_ld_st,bus_state[0]);
- opcode_is_ld_st_state_5 = Cpnt_2AND(bus_shared_AB.opcode_is_ld_st,bus_state[5]);
- shifting_not_rotation = Cpnt_2AND(bus_shared_AB.shift_is_shifting, bus_stk_imm_AB.bit_shift_mode_rot_n);
- opcode_is_add_addq = Cpnt_2OR(bus_group_AB.opcode_is_add_group, bus_group_AB.opcode_is_addq_group);
- next_vc_mux_clear__misc_options = Cpnt_8OR(bus_stk_imm_AB.opcode_is_ldi_x,
                                                 bus_alu_AB.opcode_is_sxt,
                                                 bus_alu_AB.opcode_is_mul_sqrt_div,
                                                 bus_stk_imm_AB.opcode_is_shift_xx,
                                                 bus_alu_AB.opcode_is_push_ra,
                                                 bus_alu_AB.opcode_is_pop_ra,
                                                 BIT_VAL_0, BIT_VAL_0); // MOPUP

## Sheet 8 of 11
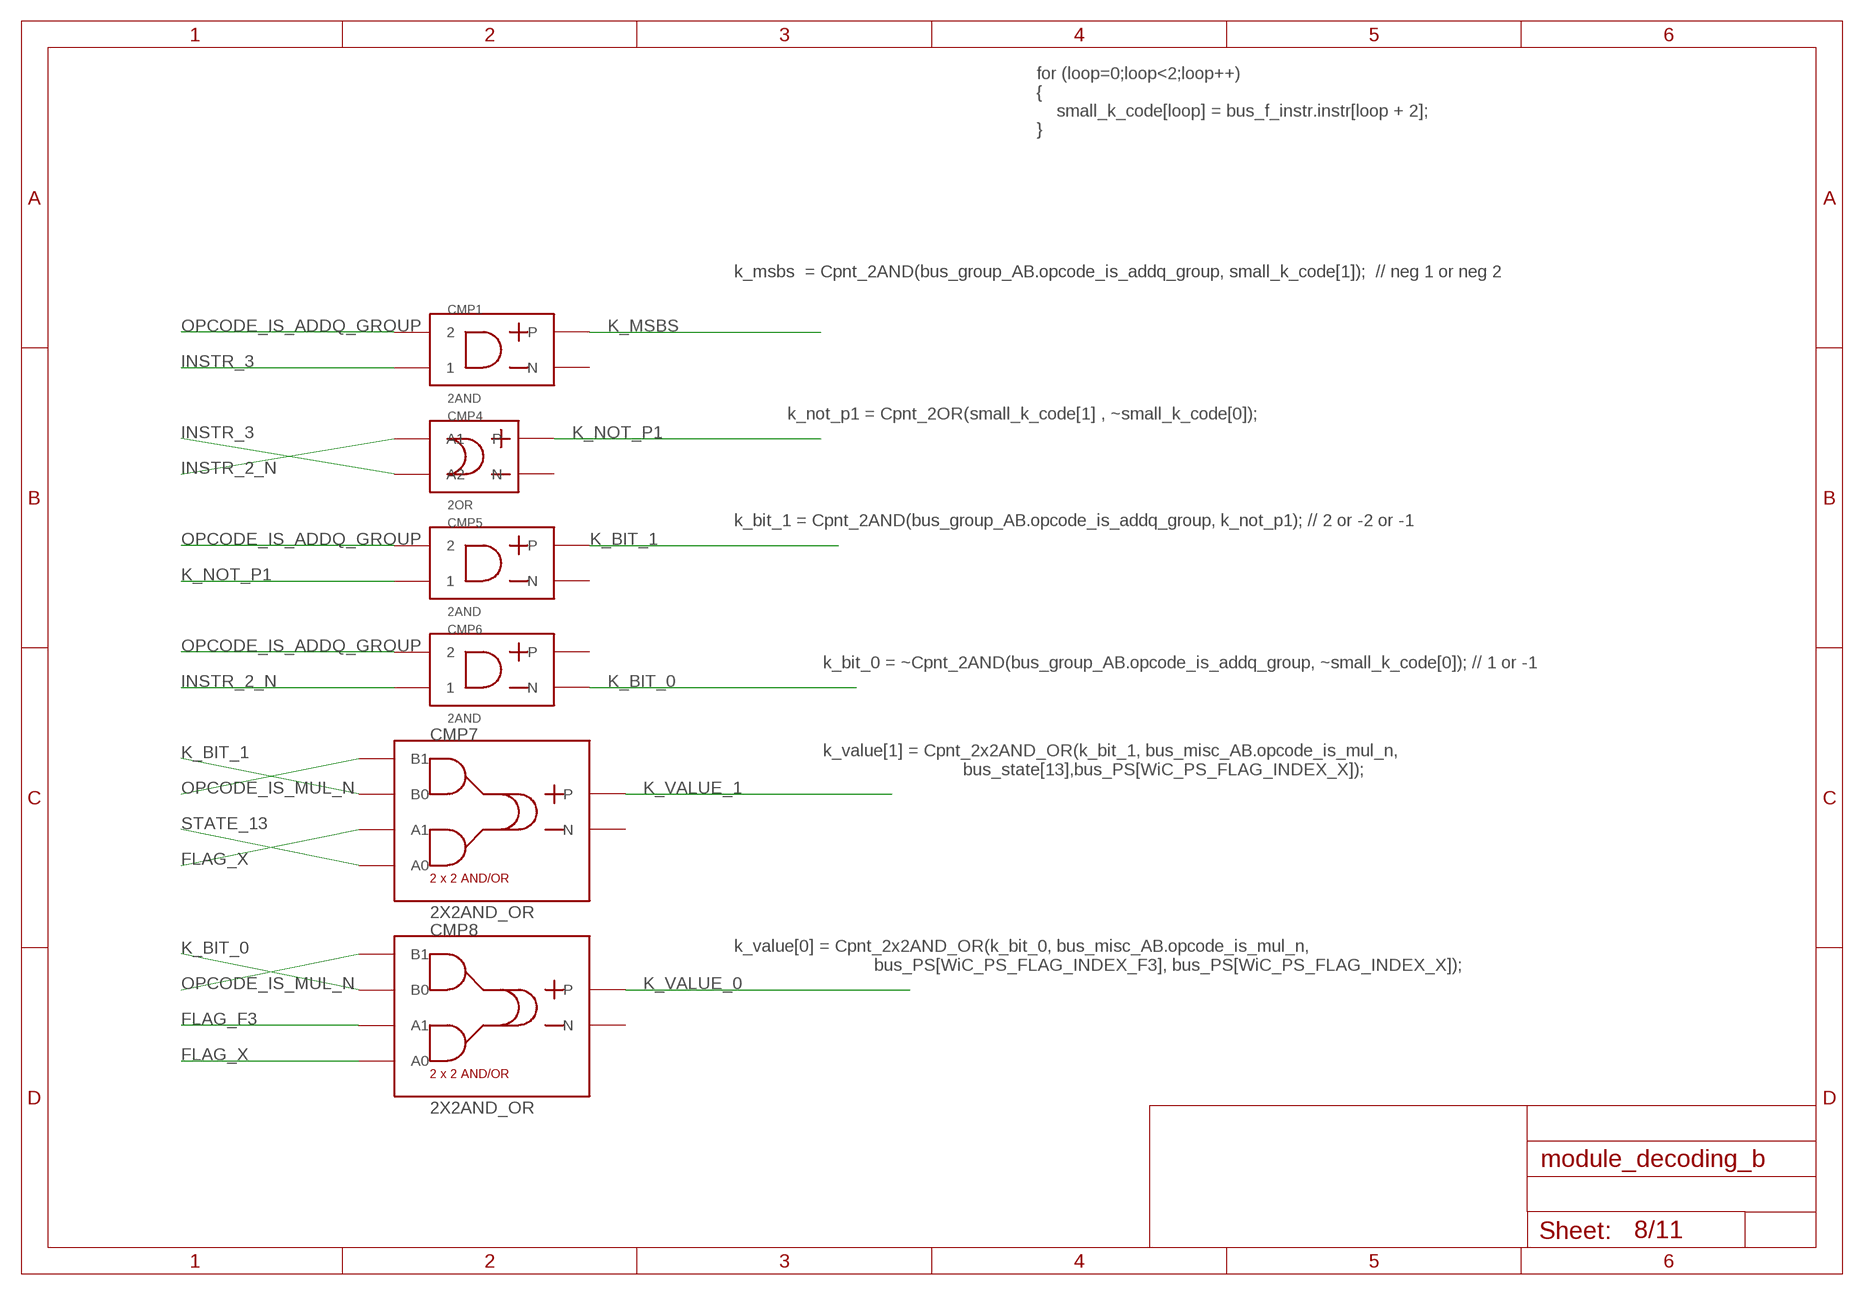
[diagram p7: schematic, sheet 8]

### Parts
CMP1  2AND  [2AND]
CMP4  2OR  [2OR]
CMP5  2AND  [2AND]
CMP6  2AND  [2AND]
CMP7  2X2AND_OR  [2X2AND_OR]
CMP8  2X2AND_OR  [2X2AND_OR]

### Nets
FLAG_F3: CMP8.P$2(A1) ; also sheet 1
FLAG_X: CMP7.P$2(A1) CMP8.P$1(A0) ; also sheet 1
INSTR_2_N: CMP4.P$2(A1) CMP6.P$1 ; also sheet 1
INSTR_3: CMP1.P$1 CMP4.P$1(A2) ; also sheet 1
K_BIT_0: CMP6.OUT_M(N) CMP8.P$3(B0)
K_BIT_1: CMP5.OUT_P(P) CMP7.P$3(B0)
K_MSBS: CMP1.OUT_P(P) ; also sheet 10
K_NOT_P1: CMP4.OUT_P(P) CMP5.P$1
K_VALUE_0: CMP8.OUT_P(P) ; also sheet 10
K_VALUE_1: CMP7.OUT_P(P) ; also sheet 10
OPCODE_IS_ADDQ_GROUP: CMP1.P$2 CMP5.P$2 CMP6.P$2 ; also sheet 2,7,10
OPCODE_IS_MUL_N: CMP7.P$4(B1) CMP8.P$4(B1) ; also sheet 2,10
STATE_13: CMP7.P$1(A0) ; also sheet 1
Unconnected: CMP1.OUT_M(N) CMP4.OUT_M(N) CMP5.OUT_M(N) CMP6.OUT_P(P) CMP7.OUT_M(N) CMP8.OUT_M(N)

### Notes on the sheet
- for (loop=0;loop<2;loop++)
      {
          small_k_code[loop] = bus_f_instr.instr[loop + 2];
      }
- k_msbs  = Cpnt_2AND(bus_group_AB.opcode_is_addq_group, small_k_code[1]);  // neg 1 or neg 2
- k_not_p1 = Cpnt_2OR(small_k_code[1] , ~small_k_code[0]);
- k_bit_1 = Cpnt_2AND(bus_group_AB.opcode_is_addq_group, k_not_p1); // 2 or -2 or -1
- k_bit_0 = ~Cpnt_2AND(bus_group_AB.opcode_is_addq_group, ~small_k_code[0]); // 1 or -1
- k_value[1] = Cpnt_2x2AND_OR(k_bit_1, bus_misc_AB.opcode_is_mul_n,
                                  bus_state[13],bus_PS[WiC_PS_FLAG_INDEX_X]);
- k_value[0] = Cpnt_2x2AND_OR(k_bit_0, bus_misc_AB.opcode_is_mul_n,
                                  bus_PS[WiC_PS_FLAG_INDEX_F3], bus_PS[WiC_PS_FLAG_INDEX_X]);

## Sheet 9 of 11
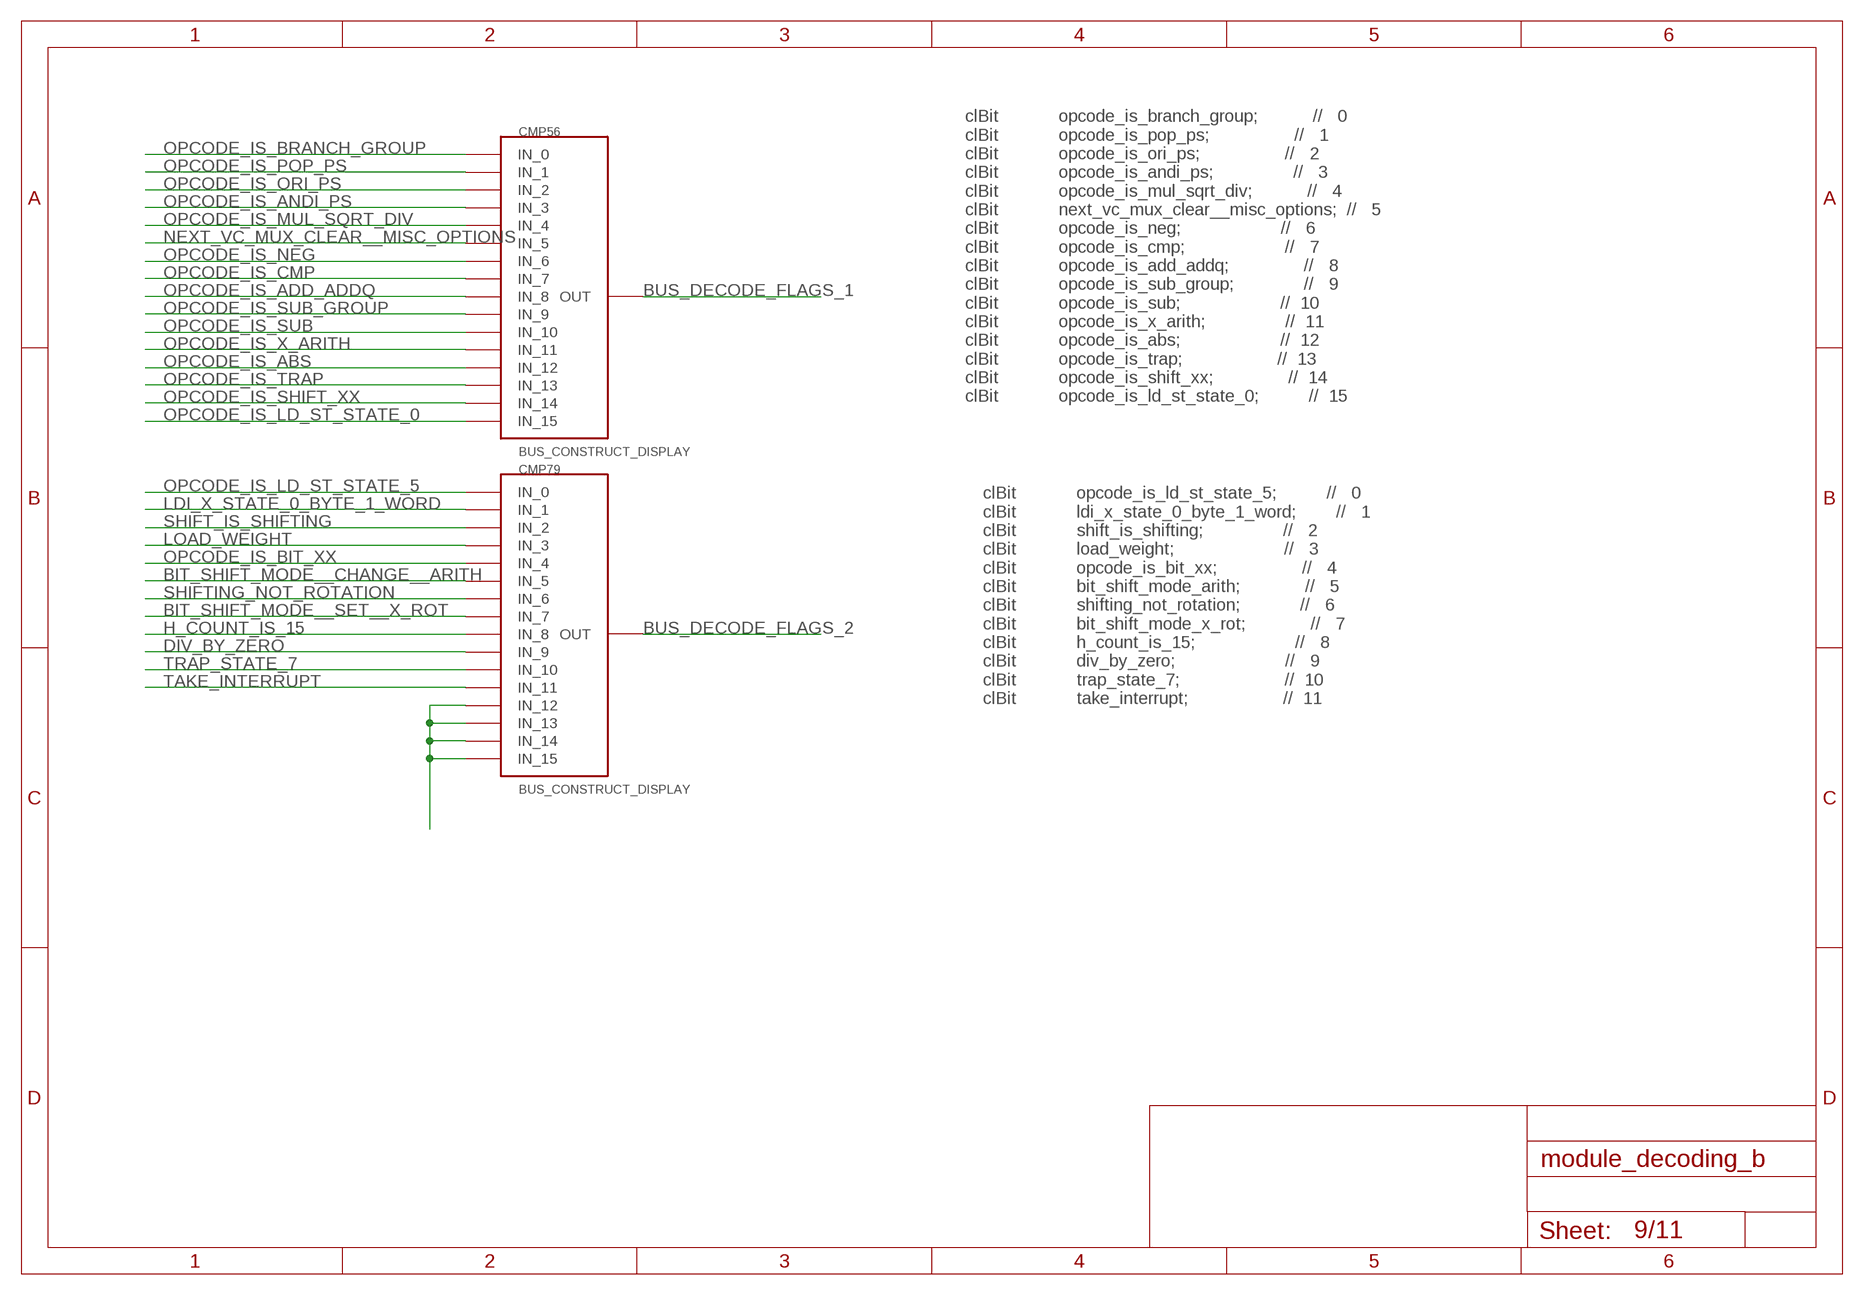
[diagram p8: schematic, sheet 9]

### Parts
CMP56  BUS_CONSTRUCT_DISPLAY  [BUS_SPLIT_DISPLAY]
CMP79  BUS_CONSTRUCT_DISPLAY  [BUS_SPLIT_DISPLAY]

### Nets
BIT_SHIFT_MODE__CHANGE__ARITH: CMP79.P$6(IN_5) ; also sheet 3
BIT_SHIFT_MODE__SET__X_ROT: CMP79.P$8(IN_7) ; also sheet 3
BUS_DECODE_FLAGS_1: CMP56.INPUT(OUT)
BUS_DECODE_FLAGS_2: CMP79.INPUT(OUT)
DIV_BY_ZERO: CMP79.P$10(IN_9) ; also sheet 3
H_COUNT_IS_15: CMP79.P$9(IN_8) ; also sheet 4
LDI_X_STATE_0_BYTE_1_WORD: CMP79.P$2(IN_1) ; also sheet 4
LOAD_WEIGHT: CMP79.P$4(IN_3) ; also sheet 4,11
N$2: CMP79.P$13(IN_12) CMP79.P$14(IN_13) CMP79.P$15(IN_14) CMP79.P$16(IN_15)
NEXT_VC_MUX_CLEAR__MISC_OPTIONS: CMP56.P$6(IN_5) ; also sheet 7
OPCODE_IS_ABS: CMP56.P$13(IN_12) ; also sheet 3,10
OPCODE_IS_ADD_ADDQ: CMP56.P$9(IN_8) ; also sheet 7
OPCODE_IS_ANDI_PS: CMP56.P$4(IN_3) ; also sheet 2
OPCODE_IS_BIT_XX: CMP79.P$5(IN_4) ; also sheet 3,6,10
OPCODE_IS_BRANCH_GROUP: CMP56.P$1(IN_0) ; also sheet 2,5
OPCODE_IS_CMP: CMP56.P$8(IN_7) ; also sheet 3,6,10
OPCODE_IS_LD_ST_STATE_0: CMP56.P$16(IN_15) ; also sheet 7
OPCODE_IS_LD_ST_STATE_5: CMP79.P$1(IN_0) ; also sheet 7
OPCODE_IS_MUL_SQRT_DIV: CMP56.P$5(IN_4) ; also sheet 3,7
OPCODE_IS_NEG: CMP56.P$7(IN_6) ; also sheet 3,10
OPCODE_IS_ORI_PS: CMP56.P$3(IN_2) ; also sheet 2
OPCODE_IS_POP_PS: CMP56.P$2(IN_1) ; also sheet 3,6,11
OPCODE_IS_SHIFT_XX: CMP56.P$15(IN_14) ; also sheet 3,7,10
OPCODE_IS_SUB: CMP56.P$11(IN_10) ; also sheet 3,10
OPCODE_IS_SUB_GROUP: CMP56.P$10(IN_9) ; also sheet 2,10
OPCODE_IS_TRAP: CMP56.P$14(IN_13) ; also sheet 3,10,11
OPCODE_IS_X_ARITH: CMP56.P$12(IN_11) ; also sheet 3,11
SHIFT_IS_SHIFTING: CMP79.P$3(IN_2) ; also sheet 4,7,10,11
SHIFTING_NOT_ROTATION: CMP79.P$7(IN_6) ; also sheet 7
TAKE_INTERRUPT: CMP79.P$12(IN_11) ; also sheet 4
TRAP_STATE_7: CMP79.P$11(IN_10) ; also sheet 4

### Notes on the sheet
- clBit            opcode_is_branch_group;           //   0
      clBit            opcode_is_pop_ps;                 //   1
      clBit            opcode_is_ori_ps;                 //   2
      clBit            opcode_is_andi_ps;                //   3
      clBit            opcode_is_mul_sqrt_div;           //   4
      clBit            next_vc_mux_clear__misc_options;  //   5
      clBit            opcode_is_neg;                    //   6
      clBit            opcode_is_cmp;                    //   7
      clBit            opcode_is_add_addq;               //   8
      clBit            opcode_is_sub_group;              //   9
      clBit            opcode_is_sub;                    //  10
      clBit            opcode_is_x_arith;                //  11
      clBit            opcode_is_abs;                    //  12
      clBit            opcode_is_trap;                   //  13
      clBit            opcode_is_shift_xx;               //  14
      clBit            opcode_is_ld_st_state_0;          //  15
- clBit            opcode_is_ld_st_state_5;          //   0
      clBit            ldi_x_state_0_byte_1_word;        //   1
      clBit            shift_is_shifting;                //   2
      clBit            load_weight;                      //   3
      clBit            opcode_is_bit_xx;                 //   4
      clBit            bit_shift_mode_arith;             //   5
      clBit            shifting_not_rotation;            //   6
      clBit            bit_shift_mode_x_rot;             //   7
      clBit            h_count_is_15;                    //   8
      clBit            div_by_zero;                      //   9
      clBit            trap_state_7;                     //  10
      clBit            take_interrupt;                   //  11

## Sheet 10 of 11
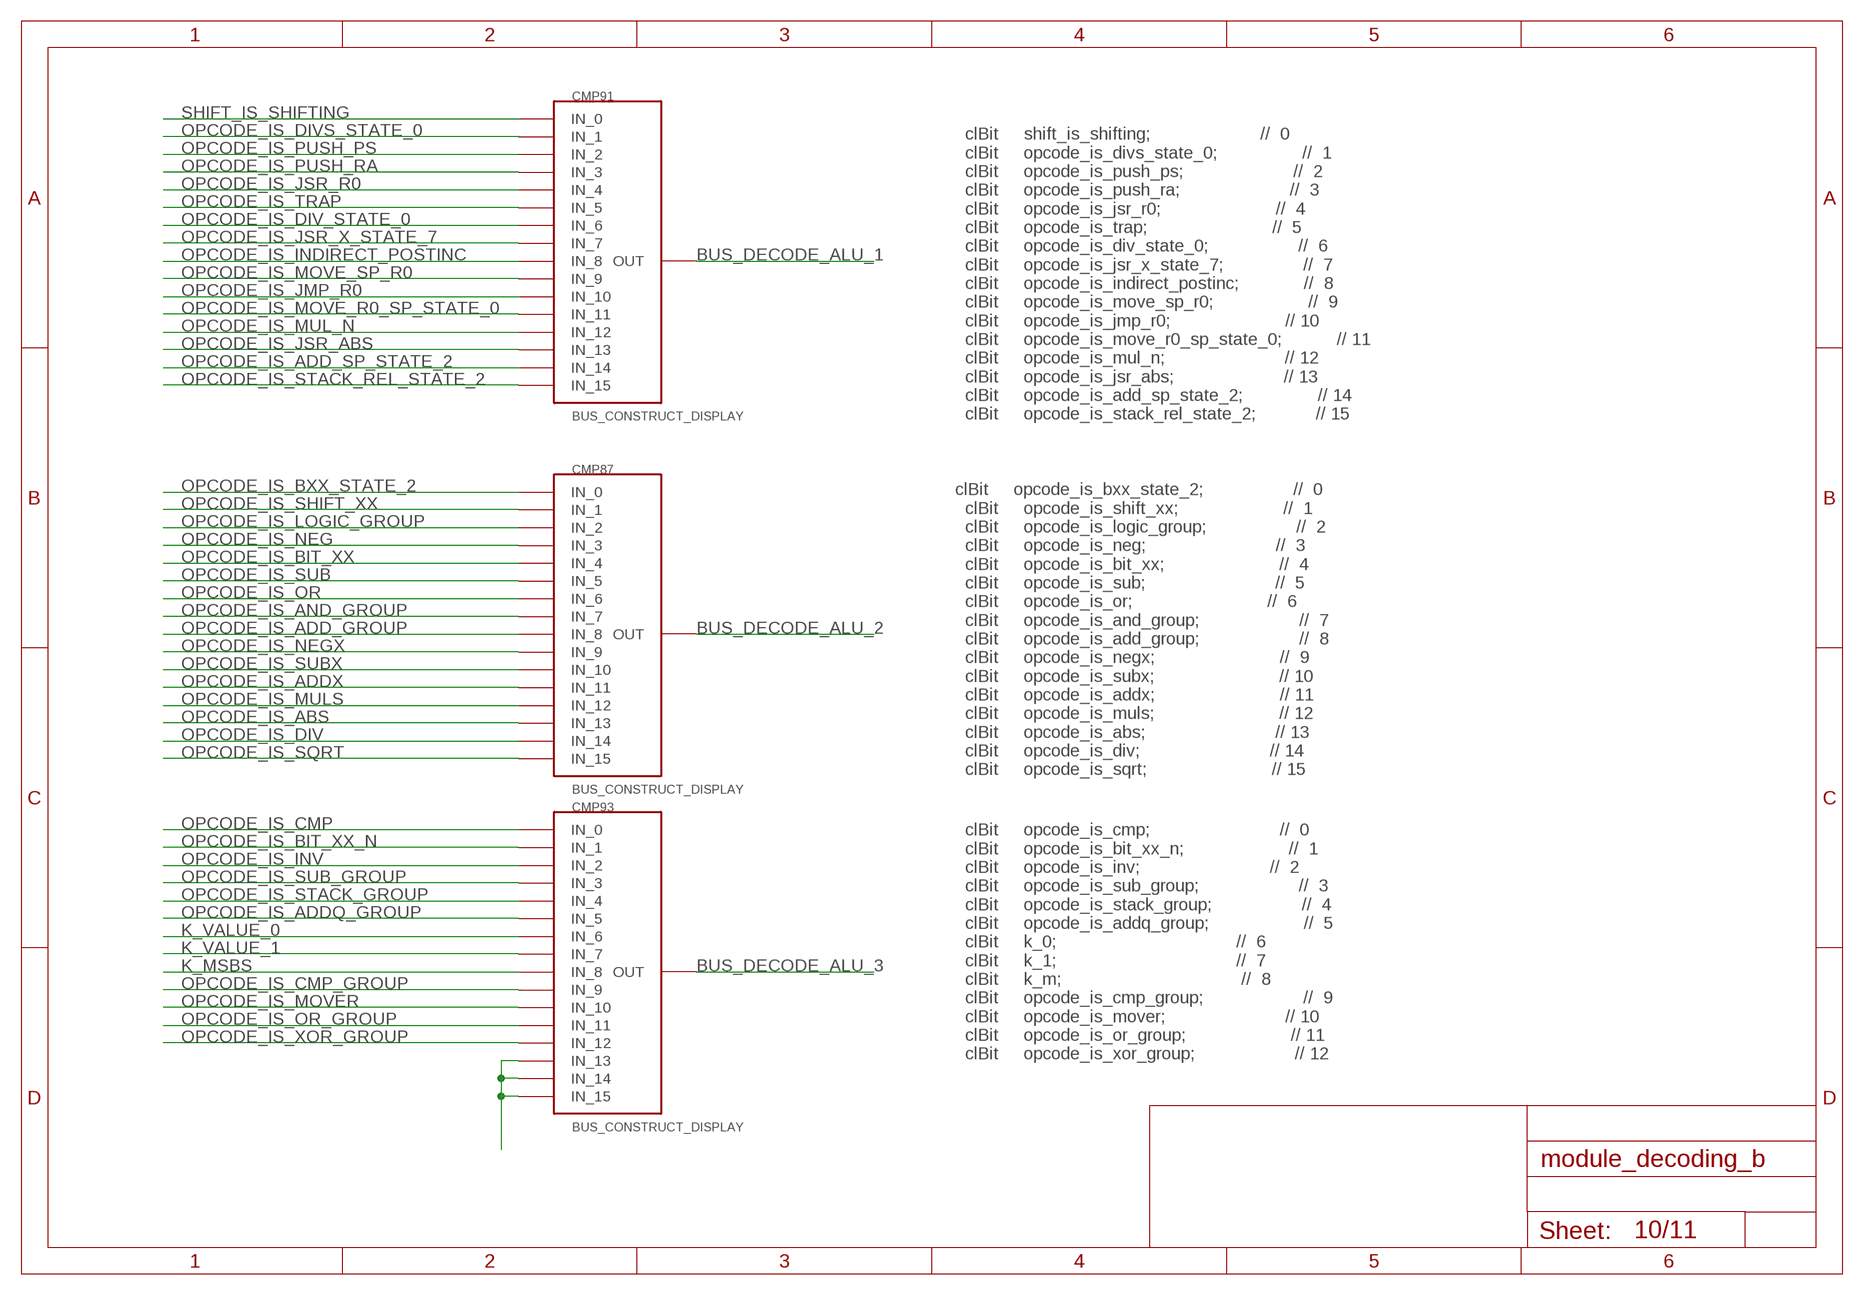
[diagram p9: schematic, sheet 10]

### Parts
CMP87  BUS_CONSTRUCT_DISPLAY  [BUS_SPLIT_DISPLAY]
CMP91  BUS_CONSTRUCT_DISPLAY  [BUS_SPLIT_DISPLAY]
CMP93  BUS_CONSTRUCT_DISPLAY  [BUS_SPLIT_DISPLAY]

### Nets
BUS_DECODE_ALU_1: CMP91.INPUT(OUT)
BUS_DECODE_ALU_2: CMP87.INPUT(OUT)
BUS_DECODE_ALU_3: CMP93.INPUT(OUT)
K_MSBS: CMP93.P$9(IN_8) ; also sheet 8
K_VALUE_0: CMP93.P$7(IN_6) ; also sheet 8
K_VALUE_1: CMP93.P$8(IN_7) ; also sheet 8
N$9: CMP93.P$14(IN_13) CMP93.P$15(IN_14) CMP93.P$16(IN_15)
OPCODE_IS_ABS: CMP87.P$14(IN_13) ; also sheet 3,9
OPCODE_IS_ADD_GROUP: CMP87.P$9(IN_8) ; also sheet 2,7
OPCODE_IS_ADD_SP_STATE_2: CMP91.P$15(IN_14) ; also sheet 5,11
OPCODE_IS_ADDQ_GROUP: CMP93.P$6(IN_5) ; also sheet 2,7,8
OPCODE_IS_ADDX: CMP87.P$12(IN_11) ; also sheet 2,11
OPCODE_IS_AND_GROUP: CMP87.P$8(IN_7) ; also sheet 2
OPCODE_IS_BIT_XX: CMP87.P$5(IN_4) ; also sheet 3,6,9
OPCODE_IS_BIT_XX_N: CMP93.P$2(IN_1) ; also sheet 3
OPCODE_IS_BXX_STATE_2: CMP87.P$1(IN_0) ; also sheet 5
OPCODE_IS_CMP: CMP93.P$1(IN_0) ; also sheet 3,6,9
OPCODE_IS_CMP_GROUP: CMP93.P$10(IN_9) ; also sheet 2
OPCODE_IS_DIV: CMP87.P$15(IN_14) ; also sheet 2,5,11
OPCODE_IS_DIV_STATE_0: CMP91.P$7(IN_6) ; also sheet 5,11
OPCODE_IS_DIVS_STATE_0: CMP91.P$2(IN_1) ; also sheet 5,11
OPCODE_IS_INDIRECT_POSTINC: CMP91.P$9(IN_8) ; also sheet 2,11
OPCODE_IS_INV: CMP93.P$3(IN_2) ; also sheet 3
OPCODE_IS_JMP_R0: CMP91.P$11(IN_10) ; also sheet 2
OPCODE_IS_JSR_ABS: CMP91.P$14(IN_13) ; also sheet 3,11
OPCODE_IS_JSR_R0: CMP91.P$5(IN_4) ; also sheet 3,11
OPCODE_IS_JSR_X_STATE_7: CMP91.P$8(IN_7) ; also sheet 5
OPCODE_IS_LOGIC_GROUP: CMP87.P$3(IN_2) ; also sheet 2
OPCODE_IS_MOVE_R0_SP_STATE_0: CMP91.P$12(IN_11) ; also sheet 5,11
OPCODE_IS_MOVE_SP_R0: CMP91.P$10(IN_9) ; also sheet 2
OPCODE_IS_MOVER: CMP93.P$11(IN_10) ; also sheet 3
OPCODE_IS_MUL_N: CMP91.P$13(IN_12) ; also sheet 2,8
OPCODE_IS_MULS: CMP87.P$13(IN_12) ; also sheet 2,11
OPCODE_IS_NEG: CMP87.P$4(IN_3) ; also sheet 3,9
OPCODE_IS_NEGX: CMP87.P$10(IN_9) ; also sheet 2,11
OPCODE_IS_OR: CMP87.P$7(IN_6) ; also sheet 3
OPCODE_IS_OR_GROUP: CMP93.P$12(IN_11) ; also sheet 2
OPCODE_IS_PUSH_PS: CMP91.P$3(IN_2) ; also sheet 3
OPCODE_IS_PUSH_RA: CMP91.P$4(IN_3) ; also sheet 3,7
OPCODE_IS_SHIFT_XX: CMP87.P$2(IN_1) ; also sheet 3,7,9
OPCODE_IS_SQRT: CMP87.P$16(IN_15) ; also sheet 2,11
OPCODE_IS_STACK_GROUP: CMP93.P$5(IN_4) ; also sheet 2,11
OPCODE_IS_STACK_REL_STATE_2: CMP91.P$16(IN_15) ; also sheet 5,11
OPCODE_IS_SUB: CMP87.P$6(IN_5) ; also sheet 3,9
OPCODE_IS_SUB_GROUP: CMP93.P$4(IN_3) ; also sheet 2,9
OPCODE_IS_SUBX: CMP87.P$11(IN_10) ; also sheet 2,11
OPCODE_IS_TRAP: CMP91.P$6(IN_5) ; also sheet 3,9,11
OPCODE_IS_XOR_GROUP: CMP93.P$13(IN_12) ; also sheet 2
SHIFT_IS_SHIFTING: CMP91.P$1(IN_0) ; also sheet 4,7,9,11

### Notes on the sheet
- clBit     shift_is_shifting;                      //  0
      clBit     opcode_is_divs_state_0;                 //  1
      clBit     opcode_is_push_ps;                      //  2
      clBit     opcode_is_push_ra;                      //  3
      clBit     opcode_is_jsr_r0;                       //  4
      clBit     opcode_is_trap;                         //  5
      clBit     opcode_is_div_state_0;                  //  6
      clBit     opcode_is_jsr_x_state_7;                //  7
      clBit     opcode_is_indirect_postinc;             //  8
      clBit     opcode_is_move_sp_r0;                   //  9
      clBit     opcode_is_jmp_r0;                       // 10
      clBit     opcode_is_move_r0_sp_state_0;           // 11
      clBit     opcode_is_mul_n;                        // 12
      clBit     opcode_is_jsr_abs;                      // 13
      clBit     opcode_is_add_sp_state_2;               // 14
      clBit     opcode_is_stack_rel_state_2;            // 15
- clBit     opcode_is_bxx_state_2;                  //  0
      clBit     opcode_is_shift_xx;                     //  1
      clBit     opcode_is_logic_group;                  //  2
      clBit     opcode_is_neg;                          //  3
      clBit     opcode_is_bit_xx;                       //  4
      clBit     opcode_is_sub;                          //  5
      clBit     opcode_is_or;                           //  6
      clBit     opcode_is_and_group;                    //  7
      clBit     opcode_is_add_group;                    //  8
      clBit     opcode_is_negx;                         //  9
      clBit     opcode_is_subx;                         // 10
      clBit     opcode_is_addx;                         // 11
      clBit     opcode_is_muls;                         // 12
      clBit     opcode_is_abs;                          // 13
      clBit     opcode_is_div;                          // 14
      clBit     opcode_is_sqrt;                         // 15
- clBit     opcode_is_cmp;                          //  0
      clBit     opcode_is_bit_xx_n;                     //  1
      clBit     opcode_is_inv;                          //  2
      clBit     opcode_is_sub_group;                    //  3
      clBit     opcode_is_stack_group;                  //  4
      clBit     opcode_is_addq_group;                   //  5
      clBit     k_0;                                    //  6
      clBit     k_1;                                    //  7
      clBit     k_m;                                    //  8
      clBit     opcode_is_cmp_group;                    //  9 
      clBit     opcode_is_mover;                        // 10
      clBit     opcode_is_or_group;                     // 11
      clBit     opcode_is_xor_group;                    // 12

## Sheet 11 of 11
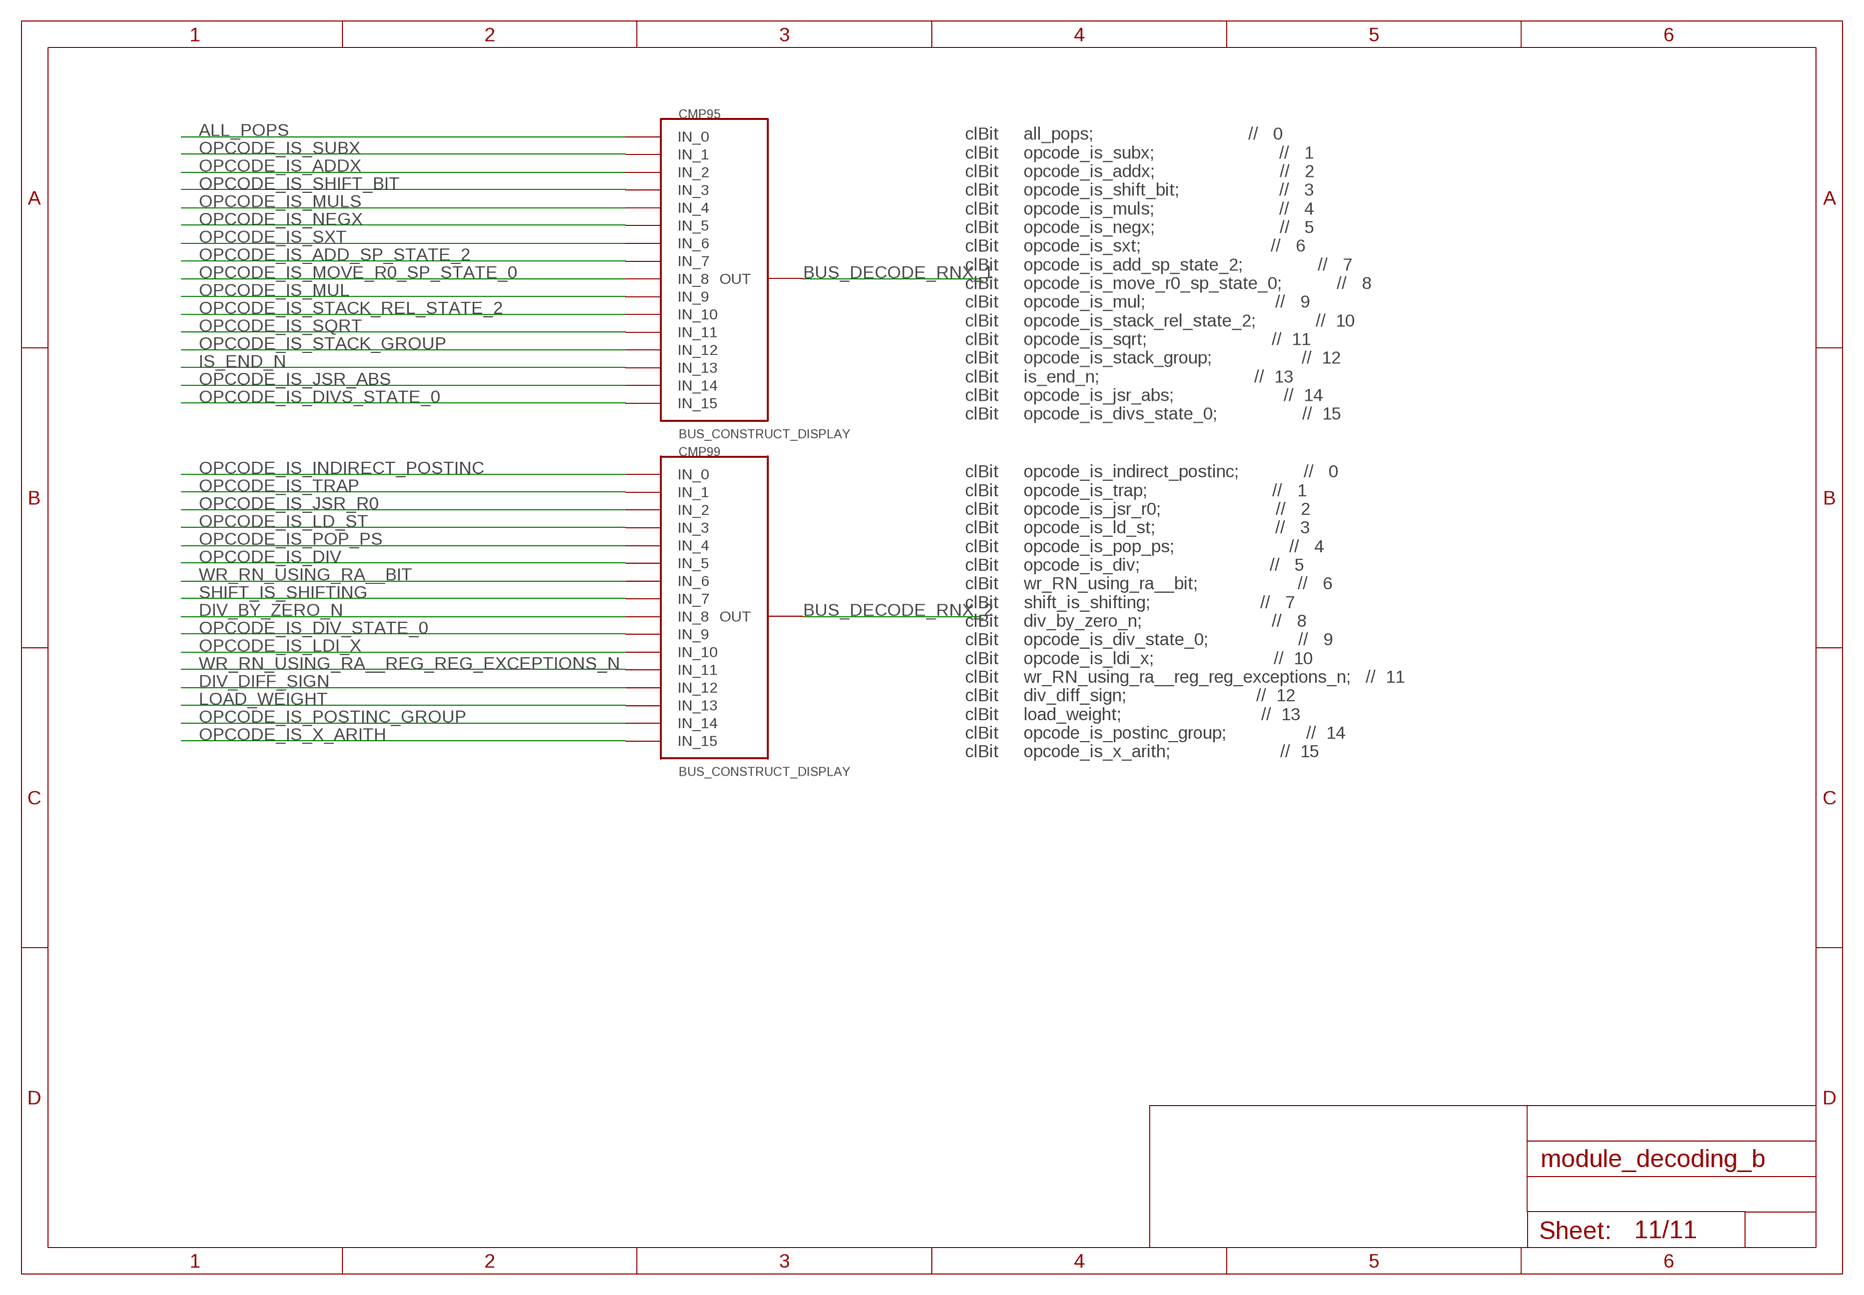
[diagram p10: schematic, sheet 11]

### Parts
CMP95  BUS_CONSTRUCT_DISPLAY  [BUS_SPLIT_DISPLAY]
CMP99  BUS_CONSTRUCT_DISPLAY  [BUS_SPLIT_DISPLAY]

### Nets
ALL_POPS: CMP95.P$1(IN_0) ; also sheet 6
BUS_DECODE_RNX_1: CMP95.INPUT(OUT)
BUS_DECODE_RNX_2: CMP99.INPUT(OUT)
DIV_BY_ZERO_N: CMP99.P$9(IN_8) ; also sheet 3
DIV_DIFF_SIGN: CMP99.P$13(IN_12) ; also sheet 6
IS_END_N: CMP95.P$14(IN_13) ; also sheet 4
LOAD_WEIGHT: CMP99.P$14(IN_13) ; also sheet 4,9
OPCODE_IS_ADD_SP_STATE_2: CMP95.P$8(IN_7) ; also sheet 5,10
OPCODE_IS_ADDX: CMP95.P$3(IN_2) ; also sheet 2,10
OPCODE_IS_DIV: CMP99.P$6(IN_5) ; also sheet 2,5,10
OPCODE_IS_DIV_STATE_0: CMP99.P$10(IN_9) ; also sheet 5,10
OPCODE_IS_DIVS_STATE_0: CMP95.P$16(IN_15) ; also sheet 5,10
OPCODE_IS_INDIRECT_POSTINC: CMP99.P$1(IN_0) ; also sheet 2,10
OPCODE_IS_JSR_ABS: CMP95.P$15(IN_14) ; also sheet 3,10
OPCODE_IS_JSR_R0: CMP99.P$3(IN_2) ; also sheet 3,10
OPCODE_IS_LD_ST: CMP99.P$4(IN_3) ; also sheet 4,7
OPCODE_IS_LDI_X: CMP99.P$11(IN_10) ; also sheet 3,7
OPCODE_IS_MOVE_R0_SP_STATE_0: CMP95.P$9(IN_8) ; also sheet 5,10
OPCODE_IS_MUL: CMP95.P$10(IN_9) ; also sheet 2
OPCODE_IS_MULS: CMP95.P$5(IN_4) ; also sheet 2,10
OPCODE_IS_NEGX: CMP95.P$6(IN_5) ; also sheet 2,10
OPCODE_IS_POP_PS: CMP99.P$5(IN_4) ; also sheet 3,6,9
OPCODE_IS_POSTINC_GROUP: CMP99.P$15(IN_14) ; also sheet 2
OPCODE_IS_SHIFT_BIT: CMP95.P$4(IN_3) ; also sheet 3
OPCODE_IS_SQRT: CMP95.P$12(IN_11) ; also sheet 2,10
OPCODE_IS_STACK_GROUP: CMP95.P$13(IN_12) ; also sheet 2,10
OPCODE_IS_STACK_REL_STATE_2: CMP95.P$11(IN_10) ; also sheet 5,10
OPCODE_IS_SUBX: CMP95.P$2(IN_1) ; also sheet 2,10
OPCODE_IS_SXT: CMP95.P$7(IN_6) ; also sheet 3,7
OPCODE_IS_TRAP: CMP99.P$2(IN_1) ; also sheet 3,9,10
OPCODE_IS_X_ARITH: CMP99.P$16(IN_15) ; also sheet 3,9
SHIFT_IS_SHIFTING: CMP99.P$8(IN_7) ; also sheet 4,7,9,10
WR_RN_USING_RA__BIT: CMP99.P$7(IN_6) ; also sheet 6
WR_RN_USING_RA__REG_REG_EXCEPTIONS_N: CMP99.P$12(IN_11) ; also sheet 6

### Notes on the sheet
- clBit     all_pops;                               //   0
      clBit     opcode_is_subx;                         //   1
      clBit     opcode_is_addx;                         //   2
      clBit     opcode_is_shift_bit;                    //   3
      clBit     opcode_is_muls;                         //   4
      clBit     opcode_is_negx;                         //   5
      clBit     opcode_is_sxt;                          //   6
      clBit     opcode_is_add_sp_state_2;               //   7
      clBit     opcode_is_move_r0_sp_state_0;           //   8
      clBit     opcode_is_mul;                          //   9
      clBit     opcode_is_stack_rel_state_2;            //  10
      clBit     opcode_is_sqrt;                         //  11
      clBit     opcode_is_stack_group;                  //  12
      clBit     is_end_n;                               //  13
      clBit     opcode_is_jsr_abs;                      //  14
      clBit     opcode_is_divs_state_0;                 //  15
- clBit     opcode_is_indirect_postinc;             //   0
      clBit     opcode_is_trap;                         //   1
      clBit     opcode_is_jsr_r0;                       //   2
      clBit     opcode_is_ld_st;                        //   3
      clBit     opcode_is_pop_ps;                       //   4
      clBit     opcode_is_div;                          //   5
      clBit     wr_RN_using_ra__bit;                    //   6
      clBit     shift_is_shifting;                      //   7
      clBit     div_by_zero_n;                          //   8
      clBit     opcode_is_div_state_0;                  //   9
      clBit     opcode_is_ldi_x;                        //  10
      clBit     wr_RN_using_ra__reg_reg_exceptions_n;   //  11
      clBit     div_diff_sign;                          //  12
      clBit     load_weight;                            //  13
      clBit     opcode_is_postinc_group;                //  14
      clBit     opcode_is_x_arith;                      //  15

## Library data of the parts
CMP1 CMP5 CMP6 CMP9-CMP11 CMP16 CMP18-CMP21 CMP41 CMP42 CMP68 = modules:2AND
CMP2 CMP3 CMP13 CMP15 CMP17 CMP35 CMP47 CMP57 = modules:BUS_SPLIT_DISPLAY
CMP4 CMP12 CMP103 = modules:2OR
CMP7 CMP8 = modules:2X2AND_OR
CMP14 = modules:8OR
CMP37 = modules:4OR
CMP56 CMP79 CMP87 CMP91 CMP93 CMP95 CMP99 = modules:BUS_CONSTRUCT_DISPLAY
CMP80 = modules:3AND
CMP100 = modules:XOR